# Altium project as14120_x31.PrjPCB (part 2 of 3)

## Sheet as14120_x31_fpga_ddr.SchDoc
size A2; PageSetup: Record=PageOptions|CenterHorizontal=True|CenterVertical=True|PrintScale=1.02|XCorrection=1.00|YCorrection=1.00|PrintKind=1|BorderSize=5000000|LeftOffset=0|BottomOffset=0|Orientation=2|PaperLength=4200|PaperWidth=2970|Scale=100|PaperSource=7|PrintQuality=-4|MediaType=1|DitherType=10|PaperKind=A3 (бумага продольной резки) (297 x 420 мм)|PrintScaleMode=1
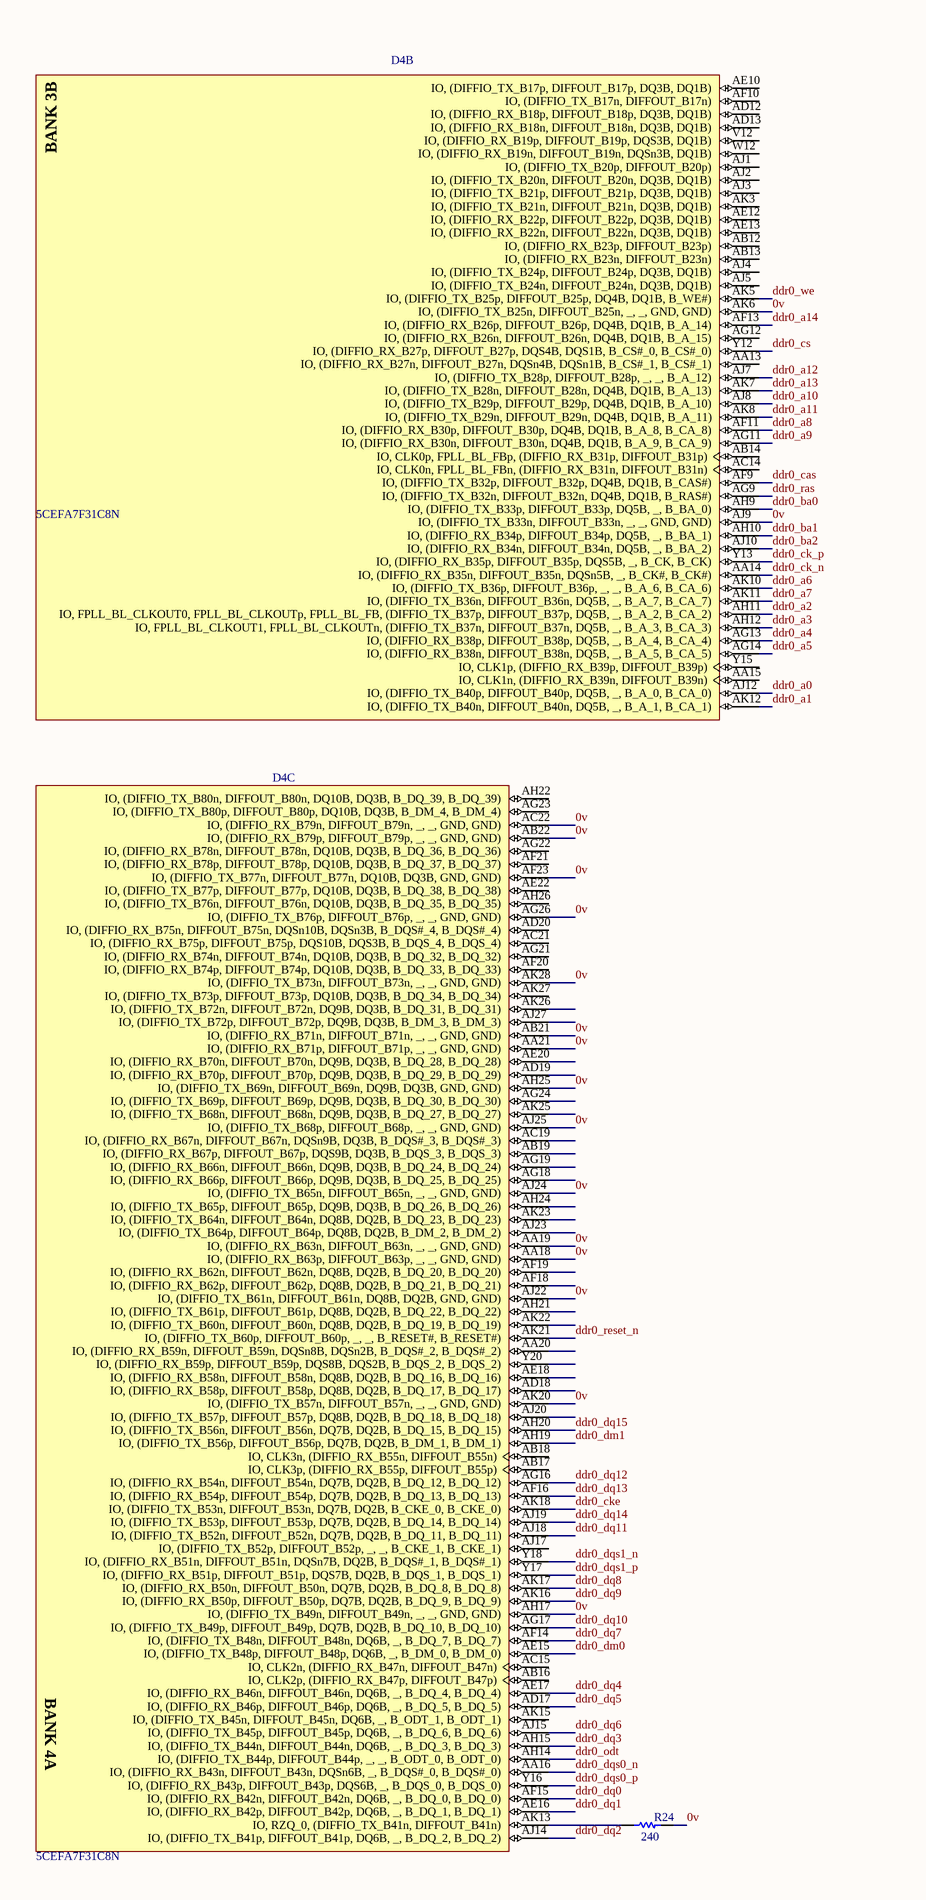
[diagram p3: as14120_x31_fpga_ddr.SchDoc, left]
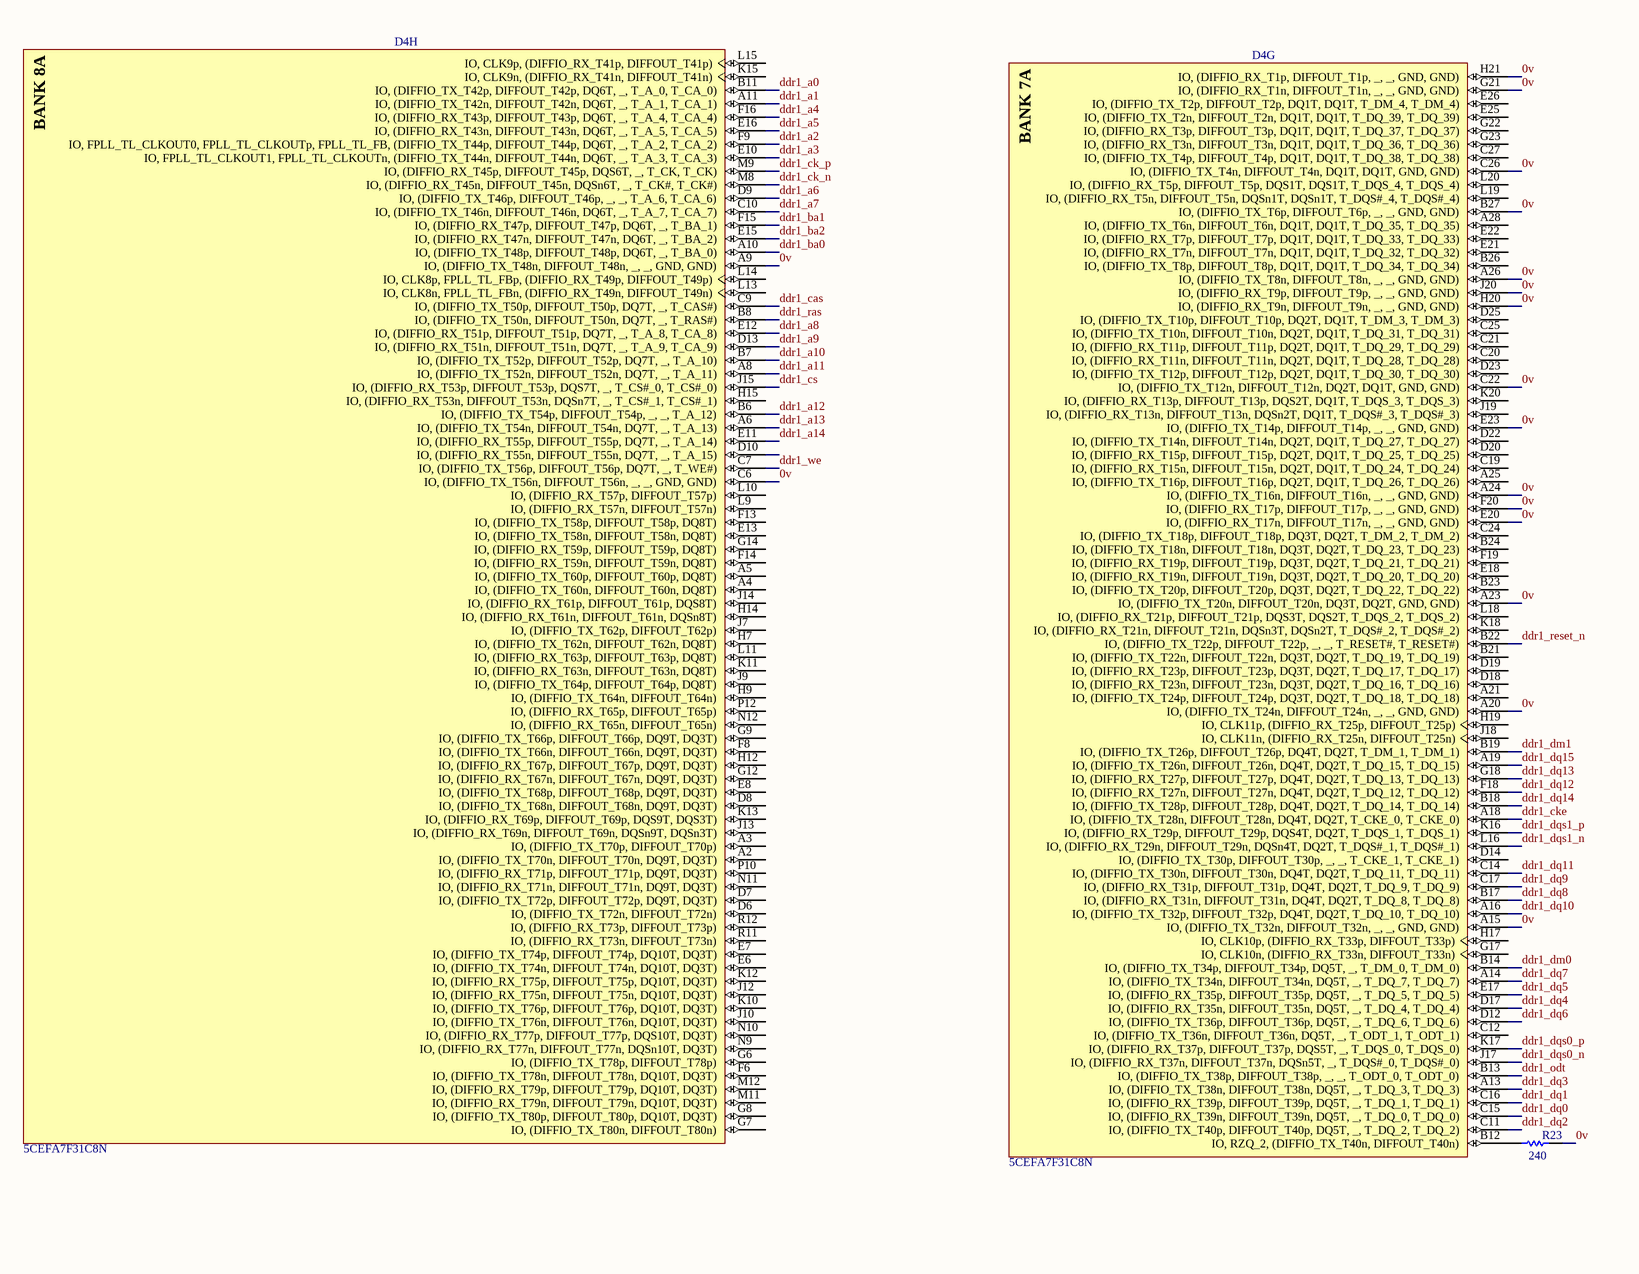
[diagram p4: as14120_x31_fpga_ddr.SchDoc, right]

### Parts
D4  5CEFA7F31C8N  [ALTR-896-FBGA-2000A]  (parts B,C,G,H of 13)
R23  value 240  [RESC0805(2012)_L]  (hidden comment: 1K 1% 0805(2012))
R24  value 240  [RESC0805(2012)_L]  (hidden comment: 1K 1% 0805(2012))

### Nets
0v: D4.A9(IO,_(DIFFIO_TX_T48n,_DIFFOUT_T48n,__,__,_GND,_GND)) D4.A15(IO,_(DIFFIO_TX_T32n,_DIFFOUT_T32n,__,__,_GND,_GND)) D4.A20(IO,_(DIFFIO_TX_T24n,_DIFFOUT_T24n,__,__,_GND,_GND)) D4.A23(IO,_(DIFFIO_TX_T20n,_DIFFOUT_T20n,_DQ3T,_DQ2T,_GND,_GND)) D4.A24(IO,_(DIFFIO_TX_T16n,_DIFFOUT_T16n,__,__,_GND,_GND)) D4.A26(IO,_(DIFFIO_TX_T8n,_DIFFOUT_T8n,__,__,_GND,_GND)) D4.AA18(IO,_(DIFFIO_RX_B63p,_DIFFOUT_B63p,__,__,_GND,_GND)) D4.AA19(IO,_(DIFFIO_RX_B63n,_DIFFOUT_B63n,__,__,_GND,_GND)) D4.AA21(IO,_(DIFFIO_RX_B71p,_DIFFOUT_B71p,__,__,_GND,_GND)) D4.AB21(IO,_(DIFFIO_RX_B71n,_DIFFOUT_B71n,__,__,_GND,_GND)) D4.AB22(IO,_(DIFFIO_RX_B79p,_DIFFOUT_B79p,__,__,_GND,_GND)) D4.AC22(IO,_(DIFFIO_RX_B79n,_DIFFOUT_B79n,__,__,_GND,_GND)) D4.AF23(IO,_(DIFFIO_TX_B77n,_DIFFOUT_B77n,_DQ10B,_DQ3B,_GND,_GND)) D4.AG26(IO,_(DIFFIO_TX_B76p,_DIFFOUT_B76p,__,__,_GND,_GND)) D4.AH17(IO,_(DIFFIO_TX_B49n,_DIFFOUT_B49n,__,__,_GND,_GND)) D4.AH25(IO,_(DIFFIO_TX_B69n,_DIFFOUT_B69n,_DQ9B,_DQ3B,_GND,_GND)) D4.AJ9(IO,_(DIFFIO_TX_B33n,_DIFFOUT_B33n,__,__,_GND,_GND)) D4.AJ22(IO,_(DIFFIO_TX_B61n,_DIFFOUT_B61n,_DQ8B,_DQ2B,_GND,_GND)) D4.AJ24(IO,_(DIFFIO_TX_B65n,_DIFFOUT_B65n,__,__,_GND,_GND)) D4.AJ25(IO,_(DIFFIO_TX_B68p,_DIFFOUT_B68p,__,__,_GND,_GND)) D4.AK6(IO,_(DIFFIO_TX_B25n,_DIFFOUT_B25n,__,__,_GND,_GND)) D4.AK20(IO,_(DIFFIO_TX_B57n,_DIFFOUT_B57n,__,__,_GND,_GND)) D4.AK28(IO,_(DIFFIO_TX_B73n,_DIFFOUT_B73n,__,__,_GND,_GND)) D4.B27(IO,_(DIFFIO_TX_T6p,_DIFFOUT_T6p,__,__,_GND,_GND)) D4.C6(IO,_(DIFFIO_TX_T56n,_DIFFOUT_T56n,__,__,_GND,_GND)) D4.C22(IO,_(DIFFIO_TX_T12n,_DIFFOUT_T12n,_DQ2T,_DQ1T,_GND,_GND)) D4.C26(IO,_(DIFFIO_TX_T4n,_DIFFOUT_T4n,_DQ1T,_DQ1T,_GND,_GND)) D4.E20(IO,_(DIFFIO_RX_T17n,_DIFFOUT_T17n,__,__,_GND,_GND)) D4.E23(IO,_(DIFFIO_TX_T14p,_DIFFOUT_T14p,__,__,_GND,_GND)) D4.F20(IO,_(DIFFIO_RX_T17p,_DIFFOUT_T17p,__,__,_GND,_GND)) D4.G21(IO,_(DIFFIO_RX_T1n,_DIFFOUT_T1n,__,__,_GND,_GND)) D4.H20(IO,_(DIFFIO_RX_T9n,_DIFFOUT_T9n,__,__,_GND,_GND)) D4.H21(IO,_(DIFFIO_RX_T1p,_DIFFOUT_T1p,__,__,_GND,_GND)) D4.J20(IO,_(DIFFIO_RX_T9p,_DIFFOUT_T9p,__,__,_GND,_GND)) R23.2 R24.2
ddr0_a0: D4.AJ12(IO,_(DIFFIO_TX_B40p,_DIFFOUT_B40p,_DQ5B,__,_B_A_0,_B_CA_0))
ddr0_a1: D4.AK12(IO,_(DIFFIO_TX_B40n,_DIFFOUT_B40n,_DQ5B,__,_B_A_1,_B_CA_1))
ddr0_a2: D4.AH11(IO,_FPLL_BL_CLKOUT0,_FPLL_BL_CLKOUTp,_FPLL_BL_FB,_(DIFFIO_TX_B37p,_DIFFOUT_B37p,_DQ5B,__,_B_A_2,_B_CA_2))
ddr0_a3: D4.AH12(IO,_FPLL_BL_CLKOUT1,_FPLL_BL_CLKOUTn,_(DIFFIO_TX_B37n,_DIFFOUT_B37n,_DQ5B,__,_B_A_3,_B_CA_3))
ddr0_a4: D4.AG13(IO,_(DIFFIO_RX_B38p,_DIFFOUT_B38p,_DQ5B,__,_B_A_4,_B_CA_4))
ddr0_a5: D4.AG14(IO,_(DIFFIO_RX_B38n,_DIFFOUT_B38n,_DQ5B,__,_B_A_5,_B_CA_5))
ddr0_a6: D4.AK10(IO,_(DIFFIO_TX_B36p,_DIFFOUT_B36p,__,__,_B_A_6,_B_CA_6))
ddr0_a7: D4.AK11(IO,_(DIFFIO_TX_B36n,_DIFFOUT_B36n,_DQ5B,__,_B_A_7,_B_CA_7))
ddr0_a8: D4.AF11(IO,_(DIFFIO_RX_B30p,_DIFFOUT_B30p,_DQ4B,_DQ1B,_B_A_8,_B_CA_8))
ddr0_a9: D4.AG11(IO,_(DIFFIO_RX_B30n,_DIFFOUT_B30n,_DQ4B,_DQ1B,_B_A_9,_B_CA_9))
ddr0_a10: D4.AJ8(IO,_(DIFFIO_TX_B29p,_DIFFOUT_B29p,_DQ4B,_DQ1B,_B_A_10))
ddr0_a11: D4.AK8(IO,_(DIFFIO_TX_B29n,_DIFFOUT_B29n,_DQ4B,_DQ1B,_B_A_11))
ddr0_a12: D4.AJ7(IO,_(DIFFIO_TX_B28p,_DIFFOUT_B28p,__,__,_B_A_12))
ddr0_a13: D4.AK7(IO,_(DIFFIO_TX_B28n,_DIFFOUT_B28n,_DQ4B,_DQ1B,_B_A_13))
ddr0_a14: D4.AF13(IO,_(DIFFIO_RX_B26p,_DIFFOUT_B26p,_DQ4B,_DQ1B,_B_A_14))
ddr0_ba0: D4.AH9(IO,_(DIFFIO_TX_B33p,_DIFFOUT_B33p,_DQ5B,__,_B_BA_0))
ddr0_ba1: D4.AH10(IO,_(DIFFIO_RX_B34p,_DIFFOUT_B34p,_DQ5B,__,_B_BA_1))
ddr0_ba2: D4.AJ10(IO,_(DIFFIO_RX_B34n,_DIFFOUT_B34n,_DQ5B,__,_B_BA_2))
ddr0_cas: D4.AF9(IO,_(DIFFIO_TX_B32p,_DIFFOUT_B32p,_DQ4B,_DQ1B,_B_CAS#))
ddr0_ck_n: D4.AA14(IO,_(DIFFIO_RX_B35n,_DIFFOUT_B35n,_DQSn5B,__,_B_CK#,_B_CK#))
ddr0_ck_p: D4.Y13(IO,_(DIFFIO_RX_B35p,_DIFFOUT_B35p,_DQS5B,__,_B_CK,_B_CK))
ddr0_cke: D4.AK18(IO,_(DIFFIO_TX_B53n,_DIFFOUT_B53n,_DQ7B,_DQ2B,_B_CKE_0,_B_CKE_0))
ddr0_cs: D4.Y12(IO,_(DIFFIO_RX_B27p,_DIFFOUT_B27p,_DQS4B,_DQS1B,_B_CS#_0,_B_CS#_0))
ddr0_dm0: D4.AE15(IO,_(DIFFIO_TX_B48p,_DIFFOUT_B48p,_DQ6B,__,_B_DM_0,_B_DM_0))
ddr0_dm1: D4.AH19(IO,_(DIFFIO_TX_B56p,_DIFFOUT_B56p,_DQ7B,_DQ2B,_B_DM_1,_B_DM_1))
ddr0_dq0: D4.AF15(IO,_(DIFFIO_RX_B42n,_DIFFOUT_B42n,_DQ6B,__,_B_DQ_0,_B_DQ_0))
ddr0_dq1: D4.AE16(IO,_(DIFFIO_RX_B42p,_DIFFOUT_B42p,_DQ6B,__,_B_DQ_1,_B_DQ_1))
ddr0_dq2: D4.AJ14(IO,_(DIFFIO_TX_B41p,_DIFFOUT_B41p,_DQ6B,__,_B_DQ_2,_B_DQ_2))
ddr0_dq3: D4.AH15(IO,_(DIFFIO_TX_B44n,_DIFFOUT_B44n,_DQ6B,__,_B_DQ_3,_B_DQ_3))
ddr0_dq4: D4.AE17(IO,_(DIFFIO_RX_B46n,_DIFFOUT_B46n,_DQ6B,__,_B_DQ_4,_B_DQ_4))
ddr0_dq5: D4.AD17(IO,_(DIFFIO_RX_B46p,_DIFFOUT_B46p,_DQ6B,__,_B_DQ_5,_B_DQ_5))
ddr0_dq6: D4.AJ15(IO,_(DIFFIO_TX_B45p,_DIFFOUT_B45p,_DQ6B,__,_B_DQ_6,_B_DQ_6))
ddr0_dq7: D4.AF14(IO,_(DIFFIO_TX_B48n,_DIFFOUT_B48n,_DQ6B,__,_B_DQ_7,_B_DQ_7))
ddr0_dq8: D4.AK17(IO,_(DIFFIO_RX_B50n,_DIFFOUT_B50n,_DQ7B,_DQ2B,_B_DQ_8,_B_DQ_8))
ddr0_dq9: D4.AK16(IO,_(DIFFIO_RX_B50p,_DIFFOUT_B50p,_DQ7B,_DQ2B,_B_DQ_9,_B_DQ_9))
ddr0_dq10: D4.AG17(IO,_(DIFFIO_TX_B49p,_DIFFOUT_B49p,_DQ7B,_DQ2B,_B_DQ_10,_B_DQ_10))
ddr0_dq11: D4.AJ18(IO,_(DIFFIO_TX_B52n,_DIFFOUT_B52n,_DQ7B,_DQ2B,_B_DQ_11,_B_DQ_11))
ddr0_dq12: D4.AG16(IO,_(DIFFIO_RX_B54n,_DIFFOUT_B54n,_DQ7B,_DQ2B,_B_DQ_12,_B_DQ_12))
ddr0_dq13: D4.AF16(IO,_(DIFFIO_RX_B54p,_DIFFOUT_B54p,_DQ7B,_DQ2B,_B_DQ_13,_B_DQ_13))
ddr0_dq14: D4.AJ19(IO,_(DIFFIO_TX_B53p,_DIFFOUT_B53p,_DQ7B,_DQ2B,_B_DQ_14,_B_DQ_14))
ddr0_dq15: D4.AH20(IO,_(DIFFIO_TX_B56n,_DIFFOUT_B56n,_DQ7B,_DQ2B,_B_DQ_15,_B_DQ_15))
ddr0_dqs0_n: D4.AA16(IO,_(DIFFIO_RX_B43n,_DIFFOUT_B43n,_DQSn6B,__,_B_DQS#_0,_B_DQS#_0))
ddr0_dqs0_p: D4.Y16(IO,_(DIFFIO_RX_B43p,_DIFFOUT_B43p,_DQS6B,__,_B_DQS_0,_B_DQS_0))
ddr0_dqs1_n: D4.Y18(IO,_(DIFFIO_RX_B51n,_DIFFOUT_B51n,_DQSn7B,_DQ2B,_B_DQS#_1,_B_DQS#_1))
ddr0_dqs1_p: D4.Y17(IO,_(DIFFIO_RX_B51p,_DIFFOUT_B51p,_DQS7B,_DQ2B,_B_DQS_1,_B_DQS_1))
ddr0_odt: D4.AH14(IO,_(DIFFIO_TX_B44p,_DIFFOUT_B44p,__,__,_B_ODT_0,_B_ODT_0))
ddr0_ras: D4.AG9(IO,_(DIFFIO_TX_B32n,_DIFFOUT_B32n,_DQ4B,_DQ1B,_B_RAS#))
ddr0_reset_n: D4.AK21(IO,_(DIFFIO_TX_B60p,_DIFFOUT_B60p,__,__,_B_RESET#,_B_RESET#))
ddr0_we: D4.AK5(IO,_(DIFFIO_TX_B25p,_DIFFOUT_B25p,_DQ4B,_DQ1B,_B_WE#))
ddr1_a0: D4.B11(IO,_(DIFFIO_TX_T42p,_DIFFOUT_T42p,_DQ6T,__,_T_A_0,_T_CA_0))
ddr1_a1: D4.A11(IO,_(DIFFIO_TX_T42n,_DIFFOUT_T42n,_DQ6T,__,_T_A_1,_T_CA_1))
ddr1_a2: D4.F9(IO,_FPLL_TL_CLKOUT0,_FPLL_TL_CLKOUTp,_FPLL_TL_FB,_(DIFFIO_TX_T44p,_DIFFOUT_T44p,_DQ6T,__,_T_A_2,_T_CA_2))
ddr1_a3: D4.E10(IO,_FPLL_TL_CLKOUT1,_FPLL_TL_CLKOUTn,_(DIFFIO_TX_T44n,_DIFFOUT_T44n,_DQ6T,__,_T_A_3,_T_CA_3))
ddr1_a4: D4.F16(IO,_(DIFFIO_RX_T43p,_DIFFOUT_T43p,_DQ6T,__,_T_A_4,_T_CA_4))
ddr1_a5: D4.E16(IO,_(DIFFIO_RX_T43n,_DIFFOUT_T43n,_DQ6T,__,_T_A_5,_T_CA_5))
ddr1_a6: D4.D9(IO,_(DIFFIO_TX_T46p,_DIFFOUT_T46p,__,__,_T_A_6,_T_CA_6))
ddr1_a7: D4.C10(IO,_(DIFFIO_TX_T46n,_DIFFOUT_T46n,_DQ6T,__,_T_A_7,_T_CA_7))
ddr1_a8: D4.E12(IO,_(DIFFIO_RX_T51p,_DIFFOUT_T51p,_DQ7T,__,_T_A_8,_T_CA_8))
ddr1_a9: D4.D13(IO,_(DIFFIO_RX_T51n,_DIFFOUT_T51n,_DQ7T,__,_T_A_9,_T_CA_9))
ddr1_a10: D4.B7(IO,_(DIFFIO_TX_T52p,_DIFFOUT_T52p,_DQ7T,__,_T_A_10))
ddr1_a11: D4.A8(IO,_(DIFFIO_TX_T52n,_DIFFOUT_T52n,_DQ7T,__,_T_A_11))
ddr1_a12: D4.B6(IO,_(DIFFIO_TX_T54p,_DIFFOUT_T54p,__,__,_T_A_12))
ddr1_a13: D4.A6(IO,_(DIFFIO_TX_T54n,_DIFFOUT_T54n,_DQ7T,__,_T_A_13))
ddr1_a14: D4.E11(IO,_(DIFFIO_RX_T55p,_DIFFOUT_T55p,_DQ7T,__,_T_A_14))
ddr1_ba0: D4.A10(IO,_(DIFFIO_TX_T48p,_DIFFOUT_T48p,_DQ6T,__,_T_BA_0))
ddr1_ba1: D4.F15(IO,_(DIFFIO_RX_T47p,_DIFFOUT_T47p,_DQ6T,__,_T_BA_1))
ddr1_ba2: D4.E15(IO,_(DIFFIO_RX_T47n,_DIFFOUT_T47n,_DQ6T,__,_T_BA_2))
ddr1_cas: D4.C9(IO,_(DIFFIO_TX_T50p,_DIFFOUT_T50p,_DQ7T,__,_T_CAS#))
ddr1_ck_n: D4.M8(IO,_(DIFFIO_RX_T45n,_DIFFOUT_T45n,_DQSn6T,__,_T_CK#,_T_CK#))
ddr1_ck_p: D4.M9(IO,_(DIFFIO_RX_T45p,_DIFFOUT_T45p,_DQS6T,__,_T_CK,_T_CK))
ddr1_cke: D4.A18(IO,_(DIFFIO_TX_T28n,_DIFFOUT_T28n,_DQ4T,_DQ2T,_T_CKE_0,_T_CKE_0))
ddr1_cs: D4.J15(IO,_(DIFFIO_RX_T53p,_DIFFOUT_T53p,_DQS7T,__,_T_CS#_0,_T_CS#_0))
ddr1_dm0: D4.B14(IO,_(DIFFIO_TX_T34p,_DIFFOUT_T34p,_DQ5T,__,_T_DM_0,_T_DM_0))
ddr1_dm1: D4.B19(IO,_(DIFFIO_TX_T26p,_DIFFOUT_T26p,_DQ4T,_DQ2T,_T_DM_1,_T_DM_1))
ddr1_dq0: D4.C15(IO,_(DIFFIO_RX_T39n,_DIFFOUT_T39n,_DQ5T,__,_T_DQ_0,_T_DQ_0))
ddr1_dq1: D4.C16(IO,_(DIFFIO_RX_T39p,_DIFFOUT_T39p,_DQ5T,__,_T_DQ_1,_T_DQ_1))
ddr1_dq2: D4.C11(IO,_(DIFFIO_TX_T40p,_DIFFOUT_T40p,_DQ5T,__,_T_DQ_2,_T_DQ_2))
ddr1_dq3: D4.A13(IO,_(DIFFIO_TX_T38n,_DIFFOUT_T38n,_DQ5T,__,_T_DQ_3,_T_DQ_3))
ddr1_dq4: D4.D17(IO,_(DIFFIO_RX_T35n,_DIFFOUT_T35n,_DQ5T,__,_T_DQ_4,_T_DQ_4))
ddr1_dq5: D4.E17(IO,_(DIFFIO_RX_T35p,_DIFFOUT_T35p,_DQ5T,__,_T_DQ_5,_T_DQ_5))
ddr1_dq6: D4.D12(IO,_(DIFFIO_TX_T36p,_DIFFOUT_T36p,_DQ5T,__,_T_DQ_6,_T_DQ_6))
ddr1_dq7: D4.A14(IO,_(DIFFIO_TX_T34n,_DIFFOUT_T34n,_DQ5T,__,_T_DQ_7,_T_DQ_7))
ddr1_dq8: D4.B17(IO,_(DIFFIO_RX_T31n,_DIFFOUT_T31n,_DQ4T,_DQ2T,_T_DQ_8,_T_DQ_8))
ddr1_dq9: D4.C17(IO,_(DIFFIO_RX_T31p,_DIFFOUT_T31p,_DQ4T,_DQ2T,_T_DQ_9,_T_DQ_9))
ddr1_dq10: D4.A16(IO,_(DIFFIO_TX_T32p,_DIFFOUT_T32p,_DQ4T,_DQ2T,_T_DQ_10,_T_DQ_10))
ddr1_dq11: D4.C14(IO,_(DIFFIO_TX_T30n,_DIFFOUT_T30n,_DQ4T,_DQ2T,_T_DQ_11,_T_DQ_11))
ddr1_dq12: D4.F18(IO,_(DIFFIO_RX_T27n,_DIFFOUT_T27n,_DQ4T,_DQ2T,_T_DQ_12,_T_DQ_12))
ddr1_dq13: D4.G18(IO,_(DIFFIO_RX_T27p,_DIFFOUT_T27p,_DQ4T,_DQ2T,_T_DQ_13,_T_DQ_13))
ddr1_dq14: D4.B18(IO,_(DIFFIO_TX_T28p,_DIFFOUT_T28p,_DQ4T,_DQ2T,_T_DQ_14,_T_DQ_14))
ddr1_dq15: D4.A19(IO,_(DIFFIO_TX_T26n,_DIFFOUT_T26n,_DQ4T,_DQ2T,_T_DQ_15,_T_DQ_15))
ddr1_dqs0_n: D4.J17(IO,_(DIFFIO_RX_T37n,_DIFFOUT_T37n,_DQSn5T,__,_T_DQS#_0,_T_DQS#_0))
ddr1_dqs0_p: D4.K17(IO,_(DIFFIO_RX_T37p,_DIFFOUT_T37p,_DQS5T,__,_T_DQS_0,_T_DQS_0))
ddr1_dqs1_n: D4.L16(IO,_(DIFFIO_RX_T29n,_DIFFOUT_T29n,_DQSn4T,_DQ2T,_T_DQS#_1,_T_DQS#_1))
ddr1_dqs1_p: D4.K16(IO,_(DIFFIO_RX_T29p,_DIFFOUT_T29p,_DQS4T,_DQ2T,_T_DQS_1,_T_DQS_1))
ddr1_odt: D4.B13(IO,_(DIFFIO_TX_T38p,_DIFFOUT_T38p,__,__,_T_ODT_0,_T_ODT_0))
ddr1_ras: D4.B8(IO,_(DIFFIO_TX_T50n,_DIFFOUT_T50n,_DQ7T,__,_T_RAS#))
ddr1_reset_n: D4.B22(IO,_(DIFFIO_TX_T22p,_DIFFOUT_T22p,__,__,_T_RESET#,_T_RESET#))
ddr1_we: D4.C7(IO,_(DIFFIO_TX_T56p,_DIFFOUT_T56p,_DQ7T,__,_T_WE#))
NetD4_AK13: D4.AK13(IO,_RZQ_0,_(DIFFIO_TX_B41n,_DIFFOUT_B41n)) R24.1
NetD4_B12: D4.B12(IO,_RZQ_2,_(DIFFIO_TX_T40n,_DIFFOUT_T40n)) R23.1

Not connected (* = marked no-connect by the designer): D4 A2(IO,_(DIFFIO_TX_T70n,_DIFFOUT_T70n,_DQ9T,_DQ3T)) A3(IO,_(DIFFIO_TX_T70p,_DIFFOUT_T70p)) A4(IO,_(DIFFIO_TX_T60n,_DIFFOUT_T60n,_DQ8T)) A5(IO,_(DIFFIO_TX_T60p,_DIFFOUT_T60p,_DQ8T)) A21(IO,_(DIFFIO_TX_T24p,_DIFFOUT_T24p,_DQ3T,_DQ2T,_T_DQ_18,_T_DQ_18)) A25(IO,_(DIFFIO_TX_T16p,_DIFFOUT_T16p,_DQ2T,_DQ1T,_T_DQ_26,_T_DQ_26)) A28(IO,_(DIFFIO_TX_T6n,_DIFFOUT_T6n,_DQ1T,_DQ1T,_T_DQ_35,_T_DQ_35)) AA13(IO,_(DIFFIO_RX_B27n,_DIFFOUT_B27n,_DQSn4B,_DQSn1B,_B_CS#_1,_B_CS#_1)) AA15(IO,_CLK1n,_(DIFFIO_RX_B39n,_DIFFOUT_B39n)) AA20(IO,_(DIFFIO_RX_B59n,_DIFFOUT_B59n,_DQSn8B,_DQSn2B,_B_DQS#_2,_B_DQS#_2)) AB12(IO,_(DIFFIO_RX_B23p,_DIFFOUT_B23p)) AB13(IO,_(DIFFIO_RX_B23n,_DIFFOUT_B23n)) AB14(IO,_CLK0p,_FPLL_BL_FBp,_(DIFFIO_RX_B31p,_DIFFOUT_B31p)) AB16(IO,_CLK2p,_(DIFFIO_RX_B47p,_DIFFOUT_B47p)) AB17(IO,_CLK3p,_(DIFFIO_RX_B55p,_DIFFOUT_B55p)) AB18(IO,_CLK3n,_(DIFFIO_RX_B55n,_DIFFOUT_B55n)) AB19(IO,_(DIFFIO_RX_B67p,_DIFFOUT_B67p,_DQS9B,_DQ3B,_B_DQS_3,_B_DQS_3)) AC14(IO,_CLK0n,_FPLL_BL_FBn,_(DIFFIO_RX_B31n,_DIFFOUT_B31n)) AC15(IO,_CLK2n,_(DIFFIO_RX_B47n,_DIFFOUT_B47n)) AC19(IO,_(DIFFIO_RX_B67n,_DIFFOUT_B67n,_DQSn9B,_DQ3B,_B_DQS#_3,_B_DQS#_3)) AC21(IO,_(DIFFIO_RX_B75p,_DIFFOUT_B75p,_DQS10B,_DQS3B,_B_DQS_4,_B_DQS_4)) AD12(IO,_(DIFFIO_RX_B18p,_DIFFOUT_B18p,_DQ3B,_DQ1B)) AD13(IO,_(DIFFIO_RX_B18n,_DIFFOUT_B18n,_DQ3B,_DQ1B)) AD18(IO,_(DIFFIO_RX_B58p,_DIFFOUT_B58p,_DQ8B,_DQ2B,_B_DQ_17,_B_DQ_17)) AD19(IO,_(DIFFIO_RX_B70p,_DIFFOUT_B70p,_DQ9B,_DQ3B,_B_DQ_29,_B_DQ_29)) AD20(IO,_(DIFFIO_RX_B75n,_DIFFOUT_B75n,_DQSn10B,_DQSn3B,_B_DQS#_4,_B_DQS#_4)) AE10(IO,_(DIFFIO_TX_B17p,_DIFFOUT_B17p,_DQ3B,_DQ1B)) AE12(IO,_(DIFFIO_RX_B22p,_DIFFOUT_B22p,_DQ3B,_DQ1B)) AE13(IO,_(DIFFIO_RX_B22n,_DIFFOUT_B22n,_DQ3B,_DQ1B)) AE18(IO,_(DIFFIO_RX_B58n,_DIFFOUT_B58n,_DQ8B,_DQ2B,_B_DQ_16,_B_DQ_16)) AE20(IO,_(DIFFIO_RX_B70n,_DIFFOUT_B70n,_DQ9B,_DQ3B,_B_DQ_28,_B_DQ_28)) AE22(IO,_(DIFFIO_TX_B77p,_DIFFOUT_B77p,_DQ10B,_DQ3B,_B_DQ_38,_B_DQ_38)) AF10(IO,_(DIFFIO_TX_B17n,_DIFFOUT_B17n)) AF18(IO,_(DIFFIO_RX_B62p,_DIFFOUT_B62p,_DQ8B,_DQ2B,_B_DQ_21,_B_DQ_21)) AF19(IO,_(DIFFIO_RX_B62n,_DIFFOUT_B62n,_DQ8B,_DQ2B,_B_DQ_20,_B_DQ_20)) AF20(IO,_(DIFFIO_RX_B74p,_DIFFOUT_B74p,_DQ10B,_DQ3B,_B_DQ_33,_B_DQ_33)) AF21(IO,_(DIFFIO_RX_B78p,_DIFFOUT_B78p,_DQ10B,_DQ3B,_B_DQ_37,_B_DQ_37)) AG12(IO,_(DIFFIO_RX_B26n,_DIFFOUT_B26n,_DQ4B,_DQ1B,_B_A_15)) AG18(IO,_(DIFFIO_RX_B66p,_DIFFOUT_B66p,_DQ9B,_DQ3B,_B_DQ_25,_B_DQ_25)) AG19(IO,_(DIFFIO_RX_B66n,_DIFFOUT_B66n,_DQ9B,_DQ3B,_B_DQ_24,_B_DQ_24)) AG21(IO,_(DIFFIO_RX_B74n,_DIFFOUT_B74n,_DQ10B,_DQ3B,_B_DQ_32,_B_DQ_32)) AG22(IO,_(DIFFIO_RX_B78n,_DIFFOUT_B78n,_DQ10B,_DQ3B,_B_DQ_36,_B_DQ_36)) AG23(IO,_(DIFFIO_TX_B80p,_DIFFOUT_B80p,_DQ10B,_DQ3B,_B_DM_4,_B_DM_4)) AG24(IO,_(DIFFIO_TX_B69p,_DIFFOUT_B69p,_DQ9B,_DQ3B,_B_DQ_30,_B_DQ_30)) AH21(IO,_(DIFFIO_TX_B61p,_DIFFOUT_B61p,_DQ8B,_DQ2B,_B_DQ_22,_B_DQ_22)) AH22(IO,_(DIFFIO_TX_B80n,_DIFFOUT_B80n,_DQ10B,_DQ3B,_B_DQ_39,_B_DQ_39)) AH24(IO,_(DIFFIO_TX_B65p,_DIFFOUT_B65p,_DQ9B,_DQ3B,_B_DQ_26,_B_DQ_26)) AH26(IO,_(DIFFIO_TX_B76n,_DIFFOUT_B76n,_DQ10B,_DQ3B,_B_DQ_35,_B_DQ_35)) AJ1(IO,_(DIFFIO_TX_B20p,_DIFFOUT_B20p)) AJ2(IO,_(DIFFIO_TX_B20n,_DIFFOUT_B20n,_DQ3B,_DQ1B)) AJ3(IO,_(DIFFIO_TX_B21p,_DIFFOUT_B21p,_DQ3B,_DQ1B)) AJ4(IO,_(DIFFIO_TX_B24p,_DIFFOUT_B24p,_DQ3B,_DQ1B)) AJ5(IO,_(DIFFIO_TX_B24n,_DIFFOUT_B24n,_DQ3B,_DQ1B)) AJ17(IO,_(DIFFIO_TX_B52p,_DIFFOUT_B52p,__,__,_B_CKE_1,_B_CKE_1)) AJ20(IO,_(DIFFIO_TX_B57p,_DIFFOUT_B57p,_DQ8B,_DQ2B,_B_DQ_18,_B_DQ_18)) AJ23(IO,_(DIFFIO_TX_B64p,_DIFFOUT_B64p,_DQ8B,_DQ2B,_B_DM_2,_B_DM_2)) AJ27(IO,_(DIFFIO_TX_B72p,_DIFFOUT_B72p,_DQ9B,_DQ3B,_B_DM_3,_B_DM_3)) AK3(IO,_(DIFFIO_TX_B21n,_DIFFOUT_B21n,_DQ3B,_DQ1B)) AK15(IO,_(DIFFIO_TX_B45n,_DIFFOUT_B45n,_DQ6B,__,_B_ODT_1,_B_ODT_1)) AK22(IO,_(DIFFIO_TX_B60n,_DIFFOUT_B60n,_DQ8B,_DQ2B,_B_DQ_19,_B_DQ_19)) AK23(IO,_(DIFFIO_TX_B64n,_DIFFOUT_B64n,_DQ8B,_DQ2B,_B_DQ_23,_B_DQ_23)) AK25(IO,_(DIFFIO_TX_B68n,_DIFFOUT_B68n,_DQ9B,_DQ3B,_B_DQ_27,_B_DQ_27)) AK26(IO,_(DIFFIO_TX_B72n,_DIFFOUT_B72n,_DQ9B,_DQ3B,_B_DQ_31,_B_DQ_31)) AK27(IO,_(DIFFIO_TX_B73p,_DIFFOUT_B73p,_DQ10B,_DQ3B,_B_DQ_34,_B_DQ_34)) B21(IO,_(DIFFIO_TX_T22n,_DIFFOUT_T22n,_DQ3T,_DQ2T,_T_DQ_19,_T_DQ_19)) B23(IO,_(DIFFIO_TX_T20p,_DIFFOUT_T20p,_DQ3T,_DQ2T,_T_DQ_22,_T_DQ_22)) B24(IO,_(DIFFIO_TX_T18n,_DIFFOUT_T18n,_DQ3T,_DQ2T,_T_DQ_23,_T_DQ_23)) B26(IO,_(DIFFIO_TX_T8p,_DIFFOUT_T8p,_DQ1T,_DQ1T,_T_DQ_34,_T_DQ_34)) C12(IO,_(DIFFIO_TX_T36n,_DIFFOUT_T36n,_DQ5T,__,_T_ODT_1,_T_ODT_1)) C19(IO,_(DIFFIO_RX_T15n,_DIFFOUT_T15n,_DQ2T,_DQ1T,_T_DQ_24,_T_DQ_24)) C20(IO,_(DIFFIO_RX_T11n,_DIFFOUT_T11n,_DQ2T,_DQ1T,_T_DQ_28,_T_DQ_28)) C21(IO,_(DIFFIO_RX_T11p,_DIFFOUT_T11p,_DQ2T,_DQ1T,_T_DQ_29,_T_DQ_29)) C24(IO,_(DIFFIO_TX_T18p,_DIFFOUT_T18p,_DQ3T,_DQ2T,_T_DM_2,_T_DM_2)) C25(IO,_(DIFFIO_TX_T10n,_DIFFOUT_T10n,_DQ2T,_DQ1T,_T_DQ_31,_T_DQ_31)) C27(IO,_(DIFFIO_TX_T4p,_DIFFOUT_T4p,_DQ1T,_DQ1T,_T_DQ_38,_T_DQ_38)) D6(IO,_(DIFFIO_TX_T72n,_DIFFOUT_T72n)) D7(IO,_(DIFFIO_TX_T72p,_DIFFOUT_T72p,_DQ9T,_DQ3T)) D8(IO,_(DIFFIO_TX_T68n,_DIFFOUT_T68n,_DQ9T,_DQ3T)) D10(IO,_(DIFFIO_RX_T55n,_DIFFOUT_T55n,_DQ7T,__,_T_A_15)) D14(IO,_(DIFFIO_TX_T30p,_DIFFOUT_T30p,__,__,_T_CKE_1,_T_CKE_1)) D18(IO,_(DIFFIO_RX_T23n,_DIFFOUT_T23n,_DQ3T,_DQ2T,_T_DQ_16,_T_DQ_16)) D19(IO,_(DIFFIO_RX_T23p,_DIFFOUT_T23p,_DQ3T,_DQ2T,_T_DQ_17,_T_DQ_17)) D20(IO,_(DIFFIO_RX_T15p,_DIFFOUT_T15p,_DQ2T,_DQ1T,_T_DQ_25,_T_DQ_25)) D22(IO,_(DIFFIO_TX_T14n,_DIFFOUT_T14n,_DQ2T,_DQ1T,_T_DQ_27,_T_DQ_27)) D23(IO,_(DIFFIO_TX_T12p,_DIFFOUT_T12p,_DQ2T,_DQ1T,_T_DQ_30,_T_DQ_30)) D25(IO,_(DIFFIO_TX_T10p,_DIFFOUT_T10p,_DQ2T,_DQ1T,_T_DM_3,_T_DM_3)) E6(IO,_(DIFFIO_TX_T74n,_DIFFOUT_T74n,_DQ10T,_DQ3T)) E7(IO,_(DIFFIO_TX_T74p,_DIFFOUT_T74p,_DQ10T,_DQ3T)) E8(IO,_(DIFFIO_TX_T68p,_DIFFOUT_T68p,_DQ9T,_DQ3T)) E13(IO,_(DIFFIO_TX_T58n,_DIFFOUT_T58n,_DQ8T)) E18(IO,_(DIFFIO_RX_T19n,_DIFFOUT_T19n,_DQ3T,_DQ2T,_T_DQ_20,_T_DQ_20)) E21(IO,_(DIFFIO_RX_T7n,_DIFFOUT_T7n,_DQ1T,_DQ1T,_T_DQ_32,_T_DQ_32)) E22(IO,_(DIFFIO_RX_T7p,_DIFFOUT_T7p,_DQ1T,_DQ1T,_T_DQ_33,_T_DQ_33)) E25(IO,_(DIFFIO_TX_T2n,_DIFFOUT_T2n,_DQ1T,_DQ1T,_T_DQ_39,_T_DQ_39)) E26(IO,_(DIFFIO_TX_T2p,_DIFFOUT_T2p,_DQ1T,_DQ1T,_T_DM_4,_T_DM_4)) F6(IO,_(DIFFIO_TX_T78n,_DIFFOUT_T78n,_DQ10T,_DQ3T)) F8(IO,_(DIFFIO_TX_T66n,_DIFFOUT_T66n,_DQ9T,_DQ3T)) F13(IO,_(DIFFIO_TX_T58p,_DIFFOUT_T58p,_DQ8T)) F14(IO,_(DIFFIO_RX_T59n,_DIFFOUT_T59n,_DQ8T)) F19(IO,_(DIFFIO_RX_T19p,_DIFFOUT_T19p,_DQ3T,_DQ2T,_T_DQ_21,_T_DQ_21)) G6(IO,_(DIFFIO_TX_T78p,_DIFFOUT_T78p)) G7(IO,_(DIFFIO_TX_T80n,_DIFFOUT_T80n)) G8(IO,_(DIFFIO_TX_T80p,_DIFFOUT_T80p,_DQ10T,_DQ3T)) G9(IO,_(DIFFIO_TX_T66p,_DIFFOUT_T66p,_DQ9T,_DQ3T)) G12(IO,_(DIFFIO_RX_T67n,_DIFFOUT_T67n,_DQ9T,_DQ3T)) G14(IO,_(DIFFIO_RX_T59p,_DIFFOUT_T59p,_DQ8T)) G17(IO,_CLK10n,_(DIFFIO_RX_T33n,_DIFFOUT_T33n)) G22(IO,_(DIFFIO_RX_T3p,_DIFFOUT_T3p,_DQ1T,_DQ1T,_T_DQ_37,_T_DQ_37)) G23(IO,_(DIFFIO_RX_T3n,_DIFFOUT_T3n,_DQ1T,_DQ1T,_T_DQ_36,_T_DQ_36)) H7(IO,_(DIFFIO_TX_T62n,_DIFFOUT_T62n,_DQ8T)) H9(IO,_(DIFFIO_TX_T64n,_DIFFOUT_T64n)) H12(IO,_(DIFFIO_RX_T67p,_DIFFOUT_T67p,_DQ9T,_DQ3T)) H14(IO,_(DIFFIO_RX_T61n,_DIFFOUT_T61n,_DQSn8T)) H15(IO,_(DIFFIO_RX_T53n,_DIFFOUT_T53n,_DQSn7T,__,_T_CS#_1,_T_CS#_1)) H17(IO,_CLK10p,_(DIFFIO_RX_T33p,_DIFFOUT_T33p)) H19(IO,_CLK11p,_(DIFFIO_RX_T25p,_DIFFOUT_T25p)) J7(IO,_(DIFFIO_TX_T62p,_DIFFOUT_T62p)) J9(IO,_(DIFFIO_TX_T64p,_DIFFOUT_T64p,_DQ8T)) J10(IO,_(DIFFIO_TX_T76n,_DIFFOUT_T76n,_DQ10T,_DQ3T)) J12(IO,_(DIFFIO_RX_T75n,_DIFFOUT_T75n,_DQ10T,_DQ3T)) J13(IO,_(DIFFIO_RX_T69n,_DIFFOUT_T69n,_DQSn9T,_DQSn3T)) J14(IO,_(DIFFIO_RX_T61p,_DIFFOUT_T61p,_DQS8T)) J18(IO,_CLK11n,_(DIFFIO_RX_T25n,_DIFFOUT_T25n)) J19(IO,_(DIFFIO_RX_T13n,_DIFFOUT_T13n,_DQSn2T,_DQ1T,_T_DQS#_3,_T_DQS#_3)) K10(IO,_(DIFFIO_TX_T76p,_DIFFOUT_T76p,_DQ10T,_DQ3T)) K11(IO,_(DIFFIO_RX_T63n,_DIFFOUT_T63n,_DQ8T)) K12(IO,_(DIFFIO_RX_T75p,_DIFFOUT_T75p,_DQ10T,_DQ3T)) K13(IO,_(DIFFIO_RX_T69p,_DIFFOUT_T69p,_DQS9T,_DQS3T)) K15(IO,_CLK9n,_(DIFFIO_RX_T41n,_DIFFOUT_T41n)) K18(IO,_(DIFFIO_RX_T21n,_DIFFOUT_T21n,_DQSn3T,_DQSn2T,_T_DQS#_2,_T_DQS#_2)) K20(IO,_(DIFFIO_RX_T13p,_DIFFOUT_T13p,_DQS2T,_DQ1T,_T_DQS_3,_T_DQS_3)) L9(IO,_(DIFFIO_RX_T57n,_DIFFOUT_T57n)) L10(IO,_(DIFFIO_RX_T57p,_DIFFOUT_T57p)) L11(IO,_(DIFFIO_RX_T63p,_DIFFOUT_T63p,_DQ8T)) L13(IO,_CLK8n,_FPLL_TL_FBn,_(DIFFIO_RX_T49n,_DIFFOUT_T49n)) L14(IO,_CLK8p,_FPLL_TL_FBp,_(DIFFIO_RX_T49p,_DIFFOUT_T49p)) L15(IO,_CLK9p,_(DIFFIO_RX_T41p,_DIFFOUT_T41p)) L18(IO,_(DIFFIO_RX_T21p,_DIFFOUT_T21p,_DQS3T,_DQS2T,_T_DQS_2,_T_DQS_2)) L19(IO,_(DIFFIO_RX_T5n,_DIFFOUT_T5n,_DQSn1T,_DQSn1T,_T_DQS#_4,_T_DQS#_4)) L20(IO,_(DIFFIO_RX_T5p,_DIFFOUT_T5p,_DQS1T,_DQS1T,_T_DQS_4,_T_DQS_4)) M11(IO,_(DIFFIO_RX_T79n,_DIFFOUT_T79n,_DQ10T,_DQ3T)) M12(IO,_(DIFFIO_RX_T79p,_DIFFOUT_T79p,_DQ10T,_DQ3T)) N9(IO,_(DIFFIO_RX_T77n,_DIFFOUT_T77n,_DQSn10T,_DQ3T)) N10(IO,_(DIFFIO_RX_T77p,_DIFFOUT_T77p,_DQS10T,_DQ3T)) N11(IO,_(DIFFIO_RX_T71n,_DIFFOUT_T71n,_DQ9T,_DQ3T)) N12(IO,_(DIFFIO_RX_T65n,_DIFFOUT_T65n)) P10(IO,_(DIFFIO_RX_T71p,_DIFFOUT_T71p,_DQ9T,_DQ3T)) P12(IO,_(DIFFIO_RX_T65p,_DIFFOUT_T65p)) R11(IO,_(DIFFIO_RX_T73n,_DIFFOUT_T73n)) R12(IO,_(DIFFIO_RX_T73p,_DIFFOUT_T73p)) V12(IO,_(DIFFIO_RX_B19p,_DIFFOUT_B19p,_DQS3B,_DQ1B)) W12(IO,_(DIFFIO_RX_B19n,_DIFFOUT_B19n,_DQSn3B,_DQ1B)) Y15(IO,_CLK1p,_(DIFFIO_RX_B39p,_DIFFOUT_B39p)) Y20(IO,_(DIFFIO_RX_B59p,_DIFFOUT_B59p,_DQS8B,_DQS2B,_B_DQS_2,_B_DQS_2))

### Notes on the sheet
- Title
- Size:
- Date:
- File:
- A2
- Number:
- Time:
- Revision:
- Sheet
- of
- (in symbol 5CEFA7F31C8N, part B) BANK 3B
- (in symbol 5CEFA7F31C8N, part C) BANK 4A
- (in symbol 5CEFA7F31C8N, part G) BANK 7A
- (in symbol 5CEFA7F31C8N, part H) BANK 8A

### Library data of the parts
D4 = 5CEFA7F31C8N: as D4 on sheet as14120_x31_fpga_ttl; DatasheetVersion: Rev. 3.1; PackageReference: 896-FBGA-2000A; PackageDescription: 896-Pin FineLine Ball-Grid Array (FBGA), Body 31 x 31 mm, Pitch 1 mm; Supplier 1: Digi-Key; Supplier Part Number 1: 544-2768-ND; Supplier 2: Mouser; Supplier Part Number 2: 989-5CEFA7F31C8N; RoHS: RoHS Compliant; Subcategory: Cyclone V E; Voltage Supply: 1.07 to 1.13 V; Mounting Technology: Surface Mount; Code_JEDEC: MS-034-AAN-1; PartNumber: 5CEFA7F31C8N; ComponentLink1Description: Manufacturer URL; ComponentLink1URL: http://www.altera.com; ComponentLink2Description: Datasheet; ComponentLink2URL: http://www.altera.com/literature/hb/cyclone-v/cv_51002.pdf; ComponentLink3Description: Package Specification; ComponentLink3URL: http://www.altera.com/devicepackaging/04R00435-01.pdf; ComponentLink4Description: Device Handbook URL; ComponentLink4URL: http://www.altera.com/literature/hb/cyclone-v/cyclone5_handbook.pdf; ComponentLink5Description: Device Overview URL; ComponentLink5URL: http://www.altera.com/literature/hb/cyclone-v/cv_51001.pdf; ComponentLink6Description: Device Pin-Out URL; ComponentLink6URL: http://www.altera.com/literature/dp/cyclone-v/1.1.txt; ComponentLink7Description: Product URL; ComponentLink7URL: http://www.buyaltera.com/scripts/partsearch.dll?Detail&name=5CEFA7F31C8N-ND
R23 R24 = RES_0805: as R57 on sheet as14120_x31_usb; Tolerance: 1 %; Power: 0.125 W; Technology: SMT

## Sheet as14120_x31_fpga_cypress.SchDoc
size A3
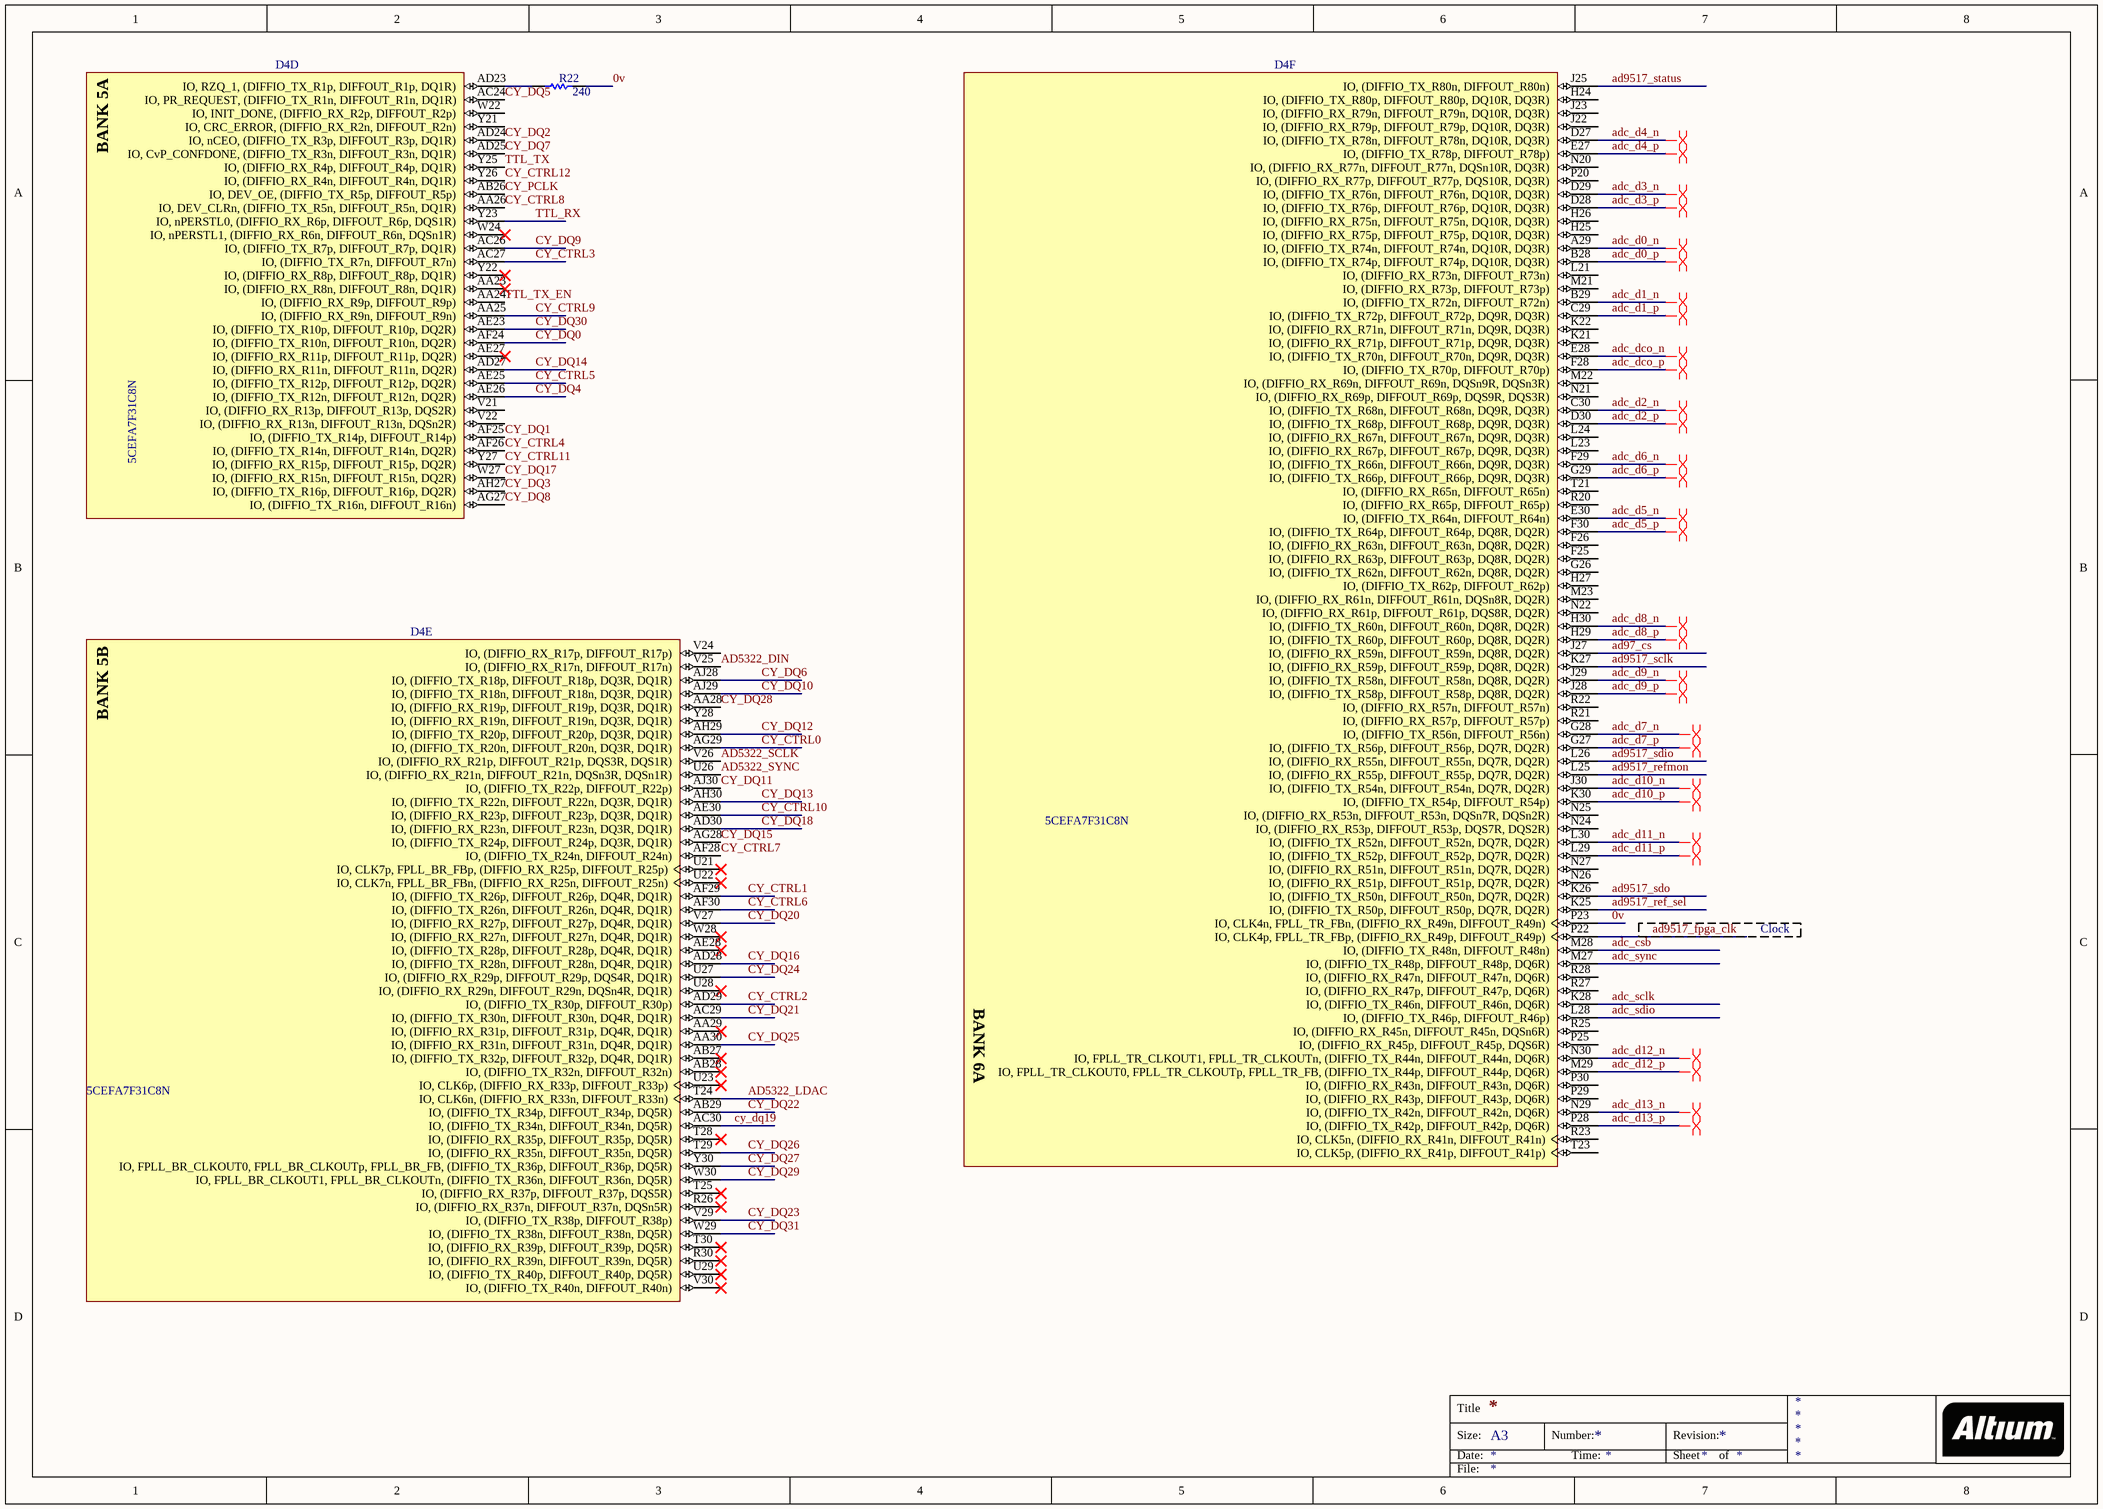
[diagram p5: as14120_x31_fpga_cypress.SchDoc]

### Parts
D4  5CEFA7F31C8N  [ALTR-896-FBGA-2000A]  (parts D,E,F of 13)
R22  240  [RESC0603(1608)_L]

### Nets
0v: D4.P23(IO,_CLK4n,_FPLL_TR_FBn,_(DIFFIO_RX_R49n,_DIFFOUT_R49n)) R22.2
ad97_cs: D4.J27(IO,_(DIFFIO_RX_R59n,_DIFFOUT_R59n,_DQ8R,_DQ2R))
AD5322_DIN: D4.V25(IO,_(DIFFIO_RX_R17n,_DIFFOUT_R17n))
AD5322_LDAC: D4.T24(IO,_CLK6n,_(DIFFIO_RX_R33n,_DIFFOUT_R33n))
AD5322_SCLK: D4.V26(IO,_(DIFFIO_RX_R21p,_DIFFOUT_R21p,_DQS3R,_DQS1R))
AD5322_SYNC: D4.U26(IO,_(DIFFIO_RX_R21n,_DIFFOUT_R21n,_DQSn3R,_DQSn1R))
ad9517_fpga_clk: D4.P22(IO,_CLK4p,_FPLL_TR_FBp,_(DIFFIO_RX_R49p,_DIFFOUT_R49p))
ad9517_ref_sel: D4.K25(IO,_(DIFFIO_TX_R50p,_DIFFOUT_R50p,_DQ7R,_DQ2R))
ad9517_refmon: D4.L25(IO,_(DIFFIO_RX_R55p,_DIFFOUT_R55p,_DQ7R,_DQ2R))
ad9517_sclk: D4.K27(IO,_(DIFFIO_RX_R59p,_DIFFOUT_R59p,_DQ8R,_DQ2R))
ad9517_sdio: D4.L26(IO,_(DIFFIO_RX_R55n,_DIFFOUT_R55n,_DQ7R,_DQ2R))
ad9517_sdo: D4.K26(IO,_(DIFFIO_TX_R50n,_DIFFOUT_R50n,_DQ7R,_DQ2R))
ad9517_status: D4.J25(IO,_(DIFFIO_TX_R80n,_DIFFOUT_R80n))
adc_csb: D4.M28(IO,_(DIFFIO_TX_R48n,_DIFFOUT_R48n))
adc_d0_n: D4.A29(IO,_(DIFFIO_TX_R74n,_DIFFOUT_R74n,_DQ10R,_DQ3R))
adc_d0_p: D4.B28(IO,_(DIFFIO_TX_R74p,_DIFFOUT_R74p,_DQ10R,_DQ3R))
adc_d1_n: D4.B29(IO,_(DIFFIO_TX_R72n,_DIFFOUT_R72n))
adc_d1_p: D4.C29(IO,_(DIFFIO_TX_R72p,_DIFFOUT_R72p,_DQ9R,_DQ3R))
adc_d2_n: D4.C30(IO,_(DIFFIO_TX_R68n,_DIFFOUT_R68n,_DQ9R,_DQ3R))
adc_d2_p: D4.D30(IO,_(DIFFIO_TX_R68p,_DIFFOUT_R68p,_DQ9R,_DQ3R))
adc_d3_n: D4.D29(IO,_(DIFFIO_TX_R76n,_DIFFOUT_R76n,_DQ10R,_DQ3R))
adc_d3_p: D4.D28(IO,_(DIFFIO_TX_R76p,_DIFFOUT_R76p,_DQ10R,_DQ3R))
adc_d4_n: D4.D27(IO,_(DIFFIO_TX_R78n,_DIFFOUT_R78n,_DQ10R,_DQ3R))
adc_d4_p: D4.E27(IO,_(DIFFIO_TX_R78p,_DIFFOUT_R78p))
adc_d5_n: D4.E30(IO,_(DIFFIO_TX_R64n,_DIFFOUT_R64n))
adc_d5_p: D4.F30(IO,_(DIFFIO_TX_R64p,_DIFFOUT_R64p,_DQ8R,_DQ2R))
adc_d6_n: D4.F29(IO,_(DIFFIO_TX_R66n,_DIFFOUT_R66n,_DQ9R,_DQ3R))
adc_d6_p: D4.G29(IO,_(DIFFIO_TX_R66p,_DIFFOUT_R66p,_DQ9R,_DQ3R))
adc_d7_n: D4.G28(IO,_(DIFFIO_TX_R56n,_DIFFOUT_R56n))
adc_d7_p: D4.G27(IO,_(DIFFIO_TX_R56p,_DIFFOUT_R56p,_DQ7R,_DQ2R))
adc_d8_n: D4.H30(IO,_(DIFFIO_TX_R60n,_DIFFOUT_R60n,_DQ8R,_DQ2R))
adc_d8_p: D4.H29(IO,_(DIFFIO_TX_R60p,_DIFFOUT_R60p,_DQ8R,_DQ2R))
adc_d9_n: D4.J29(IO,_(DIFFIO_TX_R58n,_DIFFOUT_R58n,_DQ8R,_DQ2R))
adc_d9_p: D4.J28(IO,_(DIFFIO_TX_R58p,_DIFFOUT_R58p,_DQ8R,_DQ2R))
adc_d10_n: D4.J30(IO,_(DIFFIO_TX_R54n,_DIFFOUT_R54n,_DQ7R,_DQ2R))
adc_d10_p: D4.K30(IO,_(DIFFIO_TX_R54p,_DIFFOUT_R54p))
adc_d11_n: D4.L30(IO,_(DIFFIO_TX_R52n,_DIFFOUT_R52n,_DQ7R,_DQ2R))
adc_d11_p: D4.L29(IO,_(DIFFIO_TX_R52p,_DIFFOUT_R52p,_DQ7R,_DQ2R))
adc_d12_n: D4.N30(IO,_FPLL_TR_CLKOUT1,_FPLL_TR_CLKOUTn,_(DIFFIO_TX_R44n,_DIFFOUT_R44n,_DQ6R))
adc_d12_p: D4.M29(IO,_FPLL_TR_CLKOUT0,_FPLL_TR_CLKOUTp,_FPLL_TR_FB,_(DIFFIO_TX_R44p,_DIFFOUT_R44p,_DQ6R))
adc_d13_n: D4.N29(IO,_(DIFFIO_TX_R42n,_DIFFOUT_R42n,_DQ6R))
adc_d13_p: D4.P28(IO,_(DIFFIO_TX_R42p,_DIFFOUT_R42p,_DQ6R))
adc_dco_n: D4.E28(IO,_(DIFFIO_TX_R70n,_DIFFOUT_R70n,_DQ9R,_DQ3R))
adc_dco_p: D4.F28(IO,_(DIFFIO_TX_R70p,_DIFFOUT_R70p))
adc_sclk: D4.K28(IO,_(DIFFIO_TX_R46n,_DIFFOUT_R46n,_DQ6R))
adc_sdio: D4.L28(IO,_(DIFFIO_TX_R46p,_DIFFOUT_R46p))
adc_sync: D4.M27(IO,_(DIFFIO_TX_R48p,_DIFFOUT_R48p,_DQ6R))
cy_ctrl0: D4.AG29(IO,_(DIFFIO_TX_R20n,_DIFFOUT_R20n,_DQ3R,_DQ1R))
cy_ctrl1: D4.AF29(IO,_(DIFFIO_TX_R26p,_DIFFOUT_R26p,_DQ4R,_DQ1R))
cy_ctrl2: D4.AD29(IO,_(DIFFIO_TX_R30p,_DIFFOUT_R30p))
cy_ctrl3: D4.AC27(IO,_(DIFFIO_TX_R7n,_DIFFOUT_R7n))
cy_ctrl4: D4.AF26(IO,_(DIFFIO_TX_R14n,_DIFFOUT_R14n,_DQ2R))
cy_ctrl5: D4.AE25(IO,_(DIFFIO_TX_R12p,_DIFFOUT_R12p,_DQ2R))
cy_ctrl6: D4.AF30(IO,_(DIFFIO_TX_R26n,_DIFFOUT_R26n,_DQ4R,_DQ1R))
cy_ctrl7: D4.AF28(IO,_(DIFFIO_TX_R24n,_DIFFOUT_R24n))
cy_ctrl8: D4.AA26(IO,_DEV_CLRn,_(DIFFIO_TX_R5n,_DIFFOUT_R5n,_DQ1R))
cy_ctrl9: D4.AA25(IO,_(DIFFIO_RX_R9n,_DIFFOUT_R9n))
cy_ctrl10: D4.AE30(IO,_(DIFFIO_RX_R23p,_DIFFOUT_R23p,_DQ3R,_DQ1R))
cy_ctrl11: D4.Y27(IO,_(DIFFIO_RX_R15p,_DIFFOUT_R15p,_DQ2R))
cy_ctrl12: D4.Y26(IO,_(DIFFIO_RX_R4n,_DIFFOUT_R4n,_DQ1R))
cy_dq0: D4.AF24(IO,_(DIFFIO_TX_R10n,_DIFFOUT_R10n,_DQ2R))
cy_dq1: D4.AF25(IO,_(DIFFIO_TX_R14p,_DIFFOUT_R14p))
cy_dq2: D4.AD24(IO,_nCEO,_(DIFFIO_TX_R3p,_DIFFOUT_R3p,_DQ1R))
cy_dq3: D4.AH27(IO,_(DIFFIO_TX_R16p,_DIFFOUT_R16p,_DQ2R))
cy_dq4: D4.AE26(IO,_(DIFFIO_TX_R12n,_DIFFOUT_R12n,_DQ2R))
cy_dq5: D4.AC24(IO,_PR_REQUEST,_(DIFFIO_TX_R1n,_DIFFOUT_R1n,_DQ1R))
cy_dq6: D4.AJ28(IO,_(DIFFIO_TX_R18p,_DIFFOUT_R18p,_DQ3R,_DQ1R))
cy_dq7: D4.AD25(IO,_CvP_CONFDONE,_(DIFFIO_TX_R3n,_DIFFOUT_R3n,_DQ1R))
cy_dq8: D4.AG27(IO,_(DIFFIO_TX_R16n,_DIFFOUT_R16n))
cy_dq9: D4.AC26(IO,_(DIFFIO_TX_R7p,_DIFFOUT_R7p,_DQ1R))
cy_dq10: D4.AJ29(IO,_(DIFFIO_TX_R18n,_DIFFOUT_R18n,_DQ3R,_DQ1R))
cy_dq11: D4.AJ30(IO,_(DIFFIO_TX_R22p,_DIFFOUT_R22p))
cy_dq12: D4.AH29(IO,_(DIFFIO_TX_R20p,_DIFFOUT_R20p,_DQ3R,_DQ1R))
cy_dq13: D4.AH30(IO,_(DIFFIO_TX_R22n,_DIFFOUT_R22n,_DQ3R,_DQ1R))
cy_dq14: D4.AD27(IO,_(DIFFIO_RX_R11n,_DIFFOUT_R11n,_DQ2R))
cy_dq15: D4.AG28(IO,_(DIFFIO_TX_R24p,_DIFFOUT_R24p,_DQ3R,_DQ1R))
cy_dq16: D4.AD28(IO,_(DIFFIO_TX_R28n,_DIFFOUT_R28n,_DQ4R,_DQ1R))
cy_dq17: D4.W27(IO,_(DIFFIO_RX_R15n,_DIFFOUT_R15n,_DQ2R))
cy_dq18: D4.AD30(IO,_(DIFFIO_RX_R23n,_DIFFOUT_R23n,_DQ3R,_DQ1R))
cy_dq19: D4.AC30(IO,_(DIFFIO_TX_R34n,_DIFFOUT_R34n,_DQ5R))
cy_dq20: D4.V27(IO,_(DIFFIO_RX_R27p,_DIFFOUT_R27p,_DQ4R,_DQ1R))
cy_dq21: D4.AC29(IO,_(DIFFIO_TX_R30n,_DIFFOUT_R30n,_DQ4R,_DQ1R))
cy_dq22: D4.AB29(IO,_(DIFFIO_TX_R34p,_DIFFOUT_R34p,_DQ5R))
cy_dq23: D4.V29(IO,_(DIFFIO_TX_R38p,_DIFFOUT_R38p))
cy_dq24: D4.U27(IO,_(DIFFIO_RX_R29p,_DIFFOUT_R29p,_DQS4R,_DQ1R))
cy_dq25: D4.AA30(IO,_(DIFFIO_RX_R31n,_DIFFOUT_R31n,_DQ4R,_DQ1R))
cy_dq26: D4.T29(IO,_(DIFFIO_RX_R35n,_DIFFOUT_R35n,_DQ5R))
cy_dq27: D4.Y30(IO,_FPLL_BR_CLKOUT0,_FPLL_BR_CLKOUTp,_FPLL_BR_FB,_(DIFFIO_TX_R36p,_DIFFOUT_R36p,_DQ5R))
cy_dq28: D4.AA28(IO,_(DIFFIO_RX_R19p,_DIFFOUT_R19p,_DQ3R,_DQ1R))
cy_dq29: D4.W30(IO,_FPLL_BR_CLKOUT1,_FPLL_BR_CLKOUTn,_(DIFFIO_TX_R36n,_DIFFOUT_R36n,_DQ5R))
cy_dq30: D4.AE23(IO,_(DIFFIO_TX_R10p,_DIFFOUT_R10p,_DQ2R))
cy_dq31: D4.W29(IO,_(DIFFIO_TX_R38n,_DIFFOUT_R38n,_DQ5R))
cy_pclk: D4.AB26(IO,_DEV_OE,_(DIFFIO_TX_R5p,_DIFFOUT_R5p))
ttl_rx: D4.Y23(IO,_nPERSTL0,_(DIFFIO_RX_R6p,_DIFFOUT_R6p,_DQS1R))
ttl_tx: D4.Y25(IO,_(DIFFIO_RX_R4p,_DIFFOUT_R4p,_DQ1R))
ttl_tx_en: D4.AA24(IO,_(DIFFIO_RX_R9p,_DIFFOUT_R9p))
NetD4_AD23: D4.AD23(IO,_RZQ_1,_(DIFFIO_TX_R1p,_DIFFOUT_R1p,_DQ1R)) R22.1

Not connected (* = marked no-connect by the designer): D4 AA23(IO,_(DIFFIO_RX_R8n,_DIFFOUT_R8n,_DQ1R))* AA29(IO,_(DIFFIO_RX_R31p,_DIFFOUT_R31p,_DQ4R,_DQ1R))* AB27(IO,_(DIFFIO_TX_R32p,_DIFFOUT_R32p,_DQ4R,_DQ1R))* AB28(IO,_(DIFFIO_TX_R32n,_DIFFOUT_R32n))* AE27(IO,_(DIFFIO_RX_R11p,_DIFFOUT_R11p,_DQ2R))* AE28(IO,_(DIFFIO_TX_R28p,_DIFFOUT_R28p,_DQ4R,_DQ1R))* F25(IO,_(DIFFIO_RX_R63p,_DIFFOUT_R63p,_DQ8R,_DQ2R)) F26(IO,_(DIFFIO_RX_R63n,_DIFFOUT_R63n,_DQ8R,_DQ2R)) G26(IO,_(DIFFIO_TX_R62n,_DIFFOUT_R62n,_DQ8R,_DQ2R)) H24(IO,_(DIFFIO_TX_R80p,_DIFFOUT_R80p,_DQ10R,_DQ3R)) H25(IO,_(DIFFIO_RX_R75p,_DIFFOUT_R75p,_DQ10R,_DQ3R)) H26(IO,_(DIFFIO_RX_R75n,_DIFFOUT_R75n,_DQ10R,_DQ3R)) H27(IO,_(DIFFIO_TX_R62p,_DIFFOUT_R62p)) J22(IO,_(DIFFIO_RX_R79p,_DIFFOUT_R79p,_DQ10R,_DQ3R)) J23(IO,_(DIFFIO_RX_R79n,_DIFFOUT_R79n,_DQ10R,_DQ3R)) K21(IO,_(DIFFIO_RX_R71p,_DIFFOUT_R71p,_DQ9R,_DQ3R)) K22(IO,_(DIFFIO_RX_R71n,_DIFFOUT_R71n,_DQ9R,_DQ3R)) L21(IO,_(DIFFIO_RX_R73n,_DIFFOUT_R73n)) L23(IO,_(DIFFIO_RX_R67p,_DIFFOUT_R67p,_DQ9R,_DQ3R)) L24(IO,_(DIFFIO_RX_R67n,_DIFFOUT_R67n,_DQ9R,_DQ3R)) M21(IO,_(DIFFIO_RX_R73p,_DIFFOUT_R73p)) M22(IO,_(DIFFIO_RX_R69n,_DIFFOUT_R69n,_DQSn9R,_DQSn3R)) M23(IO,_(DIFFIO_RX_R61n,_DIFFOUT_R61n,_DQSn8R,_DQ2R)) N20(IO,_(DIFFIO_RX_R77n,_DIFFOUT_R77n,_DQSn10R,_DQ3R)) N21(IO,_(DIFFIO_RX_R69p,_DIFFOUT_R69p,_DQS9R,_DQS3R)) N22(IO,_(DIFFIO_RX_R61p,_DIFFOUT_R61p,_DQS8R,_DQ2R)) N24(IO,_(DIFFIO_RX_R53p,_DIFFOUT_R53p,_DQS7R,_DQS2R)) N25(IO,_(DIFFIO_RX_R53n,_DIFFOUT_R53n,_DQSn7R,_DQSn2R)) N26(IO,_(DIFFIO_RX_R51p,_DIFFOUT_R51p,_DQ7R,_DQ2R)) N27(IO,_(DIFFIO_RX_R51n,_DIFFOUT_R51n,_DQ7R,_DQ2R)) P20(IO,_(DIFFIO_RX_R77p,_DIFFOUT_R77p,_DQS10R,_DQ3R)) P25(IO,_(DIFFIO_RX_R45p,_DIFFOUT_R45p,_DQS6R)) P29(IO,_(DIFFIO_RX_R43p,_DIFFOUT_R43p,_DQ6R)) P30(IO,_(DIFFIO_RX_R43n,_DIFFOUT_R43n,_DQ6R)) R20(IO,_(DIFFIO_RX_R65p,_DIFFOUT_R65p)) R21(IO,_(DIFFIO_RX_R57p,_DIFFOUT_R57p)) R22(IO,_(DIFFIO_RX_R57n,_DIFFOUT_R57n)) R23(IO,_CLK5n,_(DIFFIO_RX_R41n,_DIFFOUT_R41n)) R25(IO,_(DIFFIO_RX_R45n,_DIFFOUT_R45n,_DQSn6R)) R26(IO,_(DIFFIO_RX_R37n,_DIFFOUT_R37n,_DQSn5R))* R27(IO,_(DIFFIO_RX_R47p,_DIFFOUT_R47p,_DQ6R)) R28(IO,_(DIFFIO_RX_R47n,_DIFFOUT_R47n,_DQ6R)) R30(IO,_(DIFFIO_RX_R39n,_DIFFOUT_R39n,_DQ5R))* T21(IO,_(DIFFIO_RX_R65n,_DIFFOUT_R65n)) T23(IO,_CLK5p,_(DIFFIO_RX_R41p,_DIFFOUT_R41p)) T25(IO,_(DIFFIO_RX_R37p,_DIFFOUT_R37p,_DQS5R))* T28(IO,_(DIFFIO_RX_R35p,_DIFFOUT_R35p,_DQ5R))* T30(IO,_(DIFFIO_RX_R39p,_DIFFOUT_R39p,_DQ5R))* U21(IO,_CLK7p,_FPLL_BR_FBp,_(DIFFIO_RX_R25p,_DIFFOUT_R25p))* U22(IO,_CLK7n,_FPLL_BR_FBn,_(DIFFIO_RX_R25n,_DIFFOUT_R25n))* U23(IO,_CLK6p,_(DIFFIO_RX_R33p,_DIFFOUT_R33p))* U28(IO,_(DIFFIO_RX_R29n,_DIFFOUT_R29n,_DQSn4R,_DQ1R))* U29(IO,_(DIFFIO_TX_R40p,_DIFFOUT_R40p,_DQ5R))* V21(IO,_(DIFFIO_RX_R13p,_DIFFOUT_R13p,_DQS2R)) V22(IO,_(DIFFIO_RX_R13n,_DIFFOUT_R13n,_DQSn2R)) V24(IO,_(DIFFIO_RX_R17p,_DIFFOUT_R17p)) V30(IO,_(DIFFIO_TX_R40n,_DIFFOUT_R40n))* W22(IO,_INIT_DONE,_(DIFFIO_RX_R2p,_DIFFOUT_R2p)) W24(IO,_nPERSTL1,_(DIFFIO_RX_R6n,_DIFFOUT_R6n,_DQSn1R))* W28(IO,_(DIFFIO_RX_R27n,_DIFFOUT_R27n,_DQ4R,_DQ1R))* Y21(IO,_CRC_ERROR,_(DIFFIO_RX_R2n,_DIFFOUT_R2n)) Y22(IO,_(DIFFIO_RX_R8p,_DIFFOUT_R8p,_DQ1R))* Y28(IO,_(DIFFIO_RX_R19n,_DIFFOUT_R19n,_DQ3R,_DQ1R))

### Layout directives
differential pair: adc_d0_n, adc_d0_p, adc_d1_n, adc_d1_p, adc_d2_n, adc_d2_p, adc_d3_n, adc_d3_p, adc_d4_n, adc_d4_p, adc_d5_n, adc_d5_p, adc_d6_n, adc_d6_p, adc_d7_n, adc_d7_p, adc_d8_n, adc_d8_p, adc_d9_n, adc_d9_p, adc_d10_n, adc_d10_p, adc_d11_n, adc_d11_p, adc_d12_n, adc_d12_p, adc_d13_n, adc_d13_p, adc_dco_n, adc_dco_p

### Notes on the sheet
- Clock
- Title
- Size:
- Date:
- A3
- Number:
- Time:
- Revision:
- Sheet
- of
- File:
- (in symbol 5CEFA7F31C8N, part D) BANK 5A
- (in symbol 5CEFA7F31C8N, part E) BANK 5B
- (in symbol 5CEFA7F31C8N, part F) BANK 6A

### Library data of the parts
D4 = 5CEFA7F31C8N: Cyclone V E Family FPGA, 1.07 to 1.13 V Supply, 480 I/O Pins, 7 PLLs, 896-Pin FBGA, Speed Grade 8, Commercial Grade, RoHS Compliant; Manufacturer: Altera; Device Group: 5CEFA7; GPIO: 480; Logic Elements (LE) (K): 149.5; Speed Grade: 8; DatasheetVersion: Rev. 3.1; PackageReference: 896-FBGA-2000A; PackageDescription: 896-Pin FineLine Ball-Grid Array (FBGA), Body 31 x 31 mm, Pitch 1 mm; Supplier 1: Digi-Key; Supplier Part Number 1: 544-2768-ND; Supplier 2: Mouser; Supplier Part Number 2: 989-5CEFA7F31C8N; RoHS: RoHS Compliant; Subcategory: Cyclone V E; Voltage Supply: 1.07 to 1.13 V; Mounting Technology: Surface Mount; Code_JEDEC: MS-034-AAN-1; PartNumber: 5CEFA7F31C8N; ComponentLink1Description: Manufacturer URL; ComponentLink1URL: http://www.altera.com; ComponentLink2Description: Datasheet; ComponentLink2URL: http://www.altera.com/literature/hb/cyclone-v/cv_51002.pdf; ComponentLink3Description: Package Specification; ComponentLink3URL: http://www.altera.com/devicepackaging/04R00435-01.pdf; ComponentLink4Description: Device Handbook URL; ComponentLink4URL: http://www.altera.com/literature/hb/cyclone-v/cyclone5_handbook.pdf; ComponentLink5Description: Device Overview URL; ComponentLink5URL: http://www.altera.com/literature/hb/cyclone-v/cv_51001.pdf; ComponentLink6Description: Device Pin-Out URL; ComponentLink6URL: http://www.altera.com/literature/dp/cyclone-v/1.1.txt; ComponentLink7Description: Product URL; ComponentLink7URL: http://www.buyaltera.com/scripts/partsearch.dll?Detail&name=5CEFA7F31C8N-ND
R22 = RES_0603: 1K 0.1W 5% 0603 (1608 Metric)  SMD; Case-EIA: 0603; Case-Metric: 1608; Technology: SMT; Value: 240; Tolerance: 5 %; Power: 0.1 W

## Sheet as14120_x31_ddr.SchDoc
size A3; PageSetup: Record=PageOptions|CenterHorizontal=True|CenterVertical=True|PrintScale=1.05|XCorrection=1.00|YCorrection=1.00|PrintKind=0|BorderSize=5000000|LeftOffset=0|BottomOffset=0|Orientation=2|PaperLength=3060|PaperWidth=2190|Scale=100|PaperSource=7|PrintQuality=-4|MediaType=1|DitherType=10|PaperKind=A3 (без полей / бумага продольной резки) (297 x 420 мм)|PrintScaleMode=1
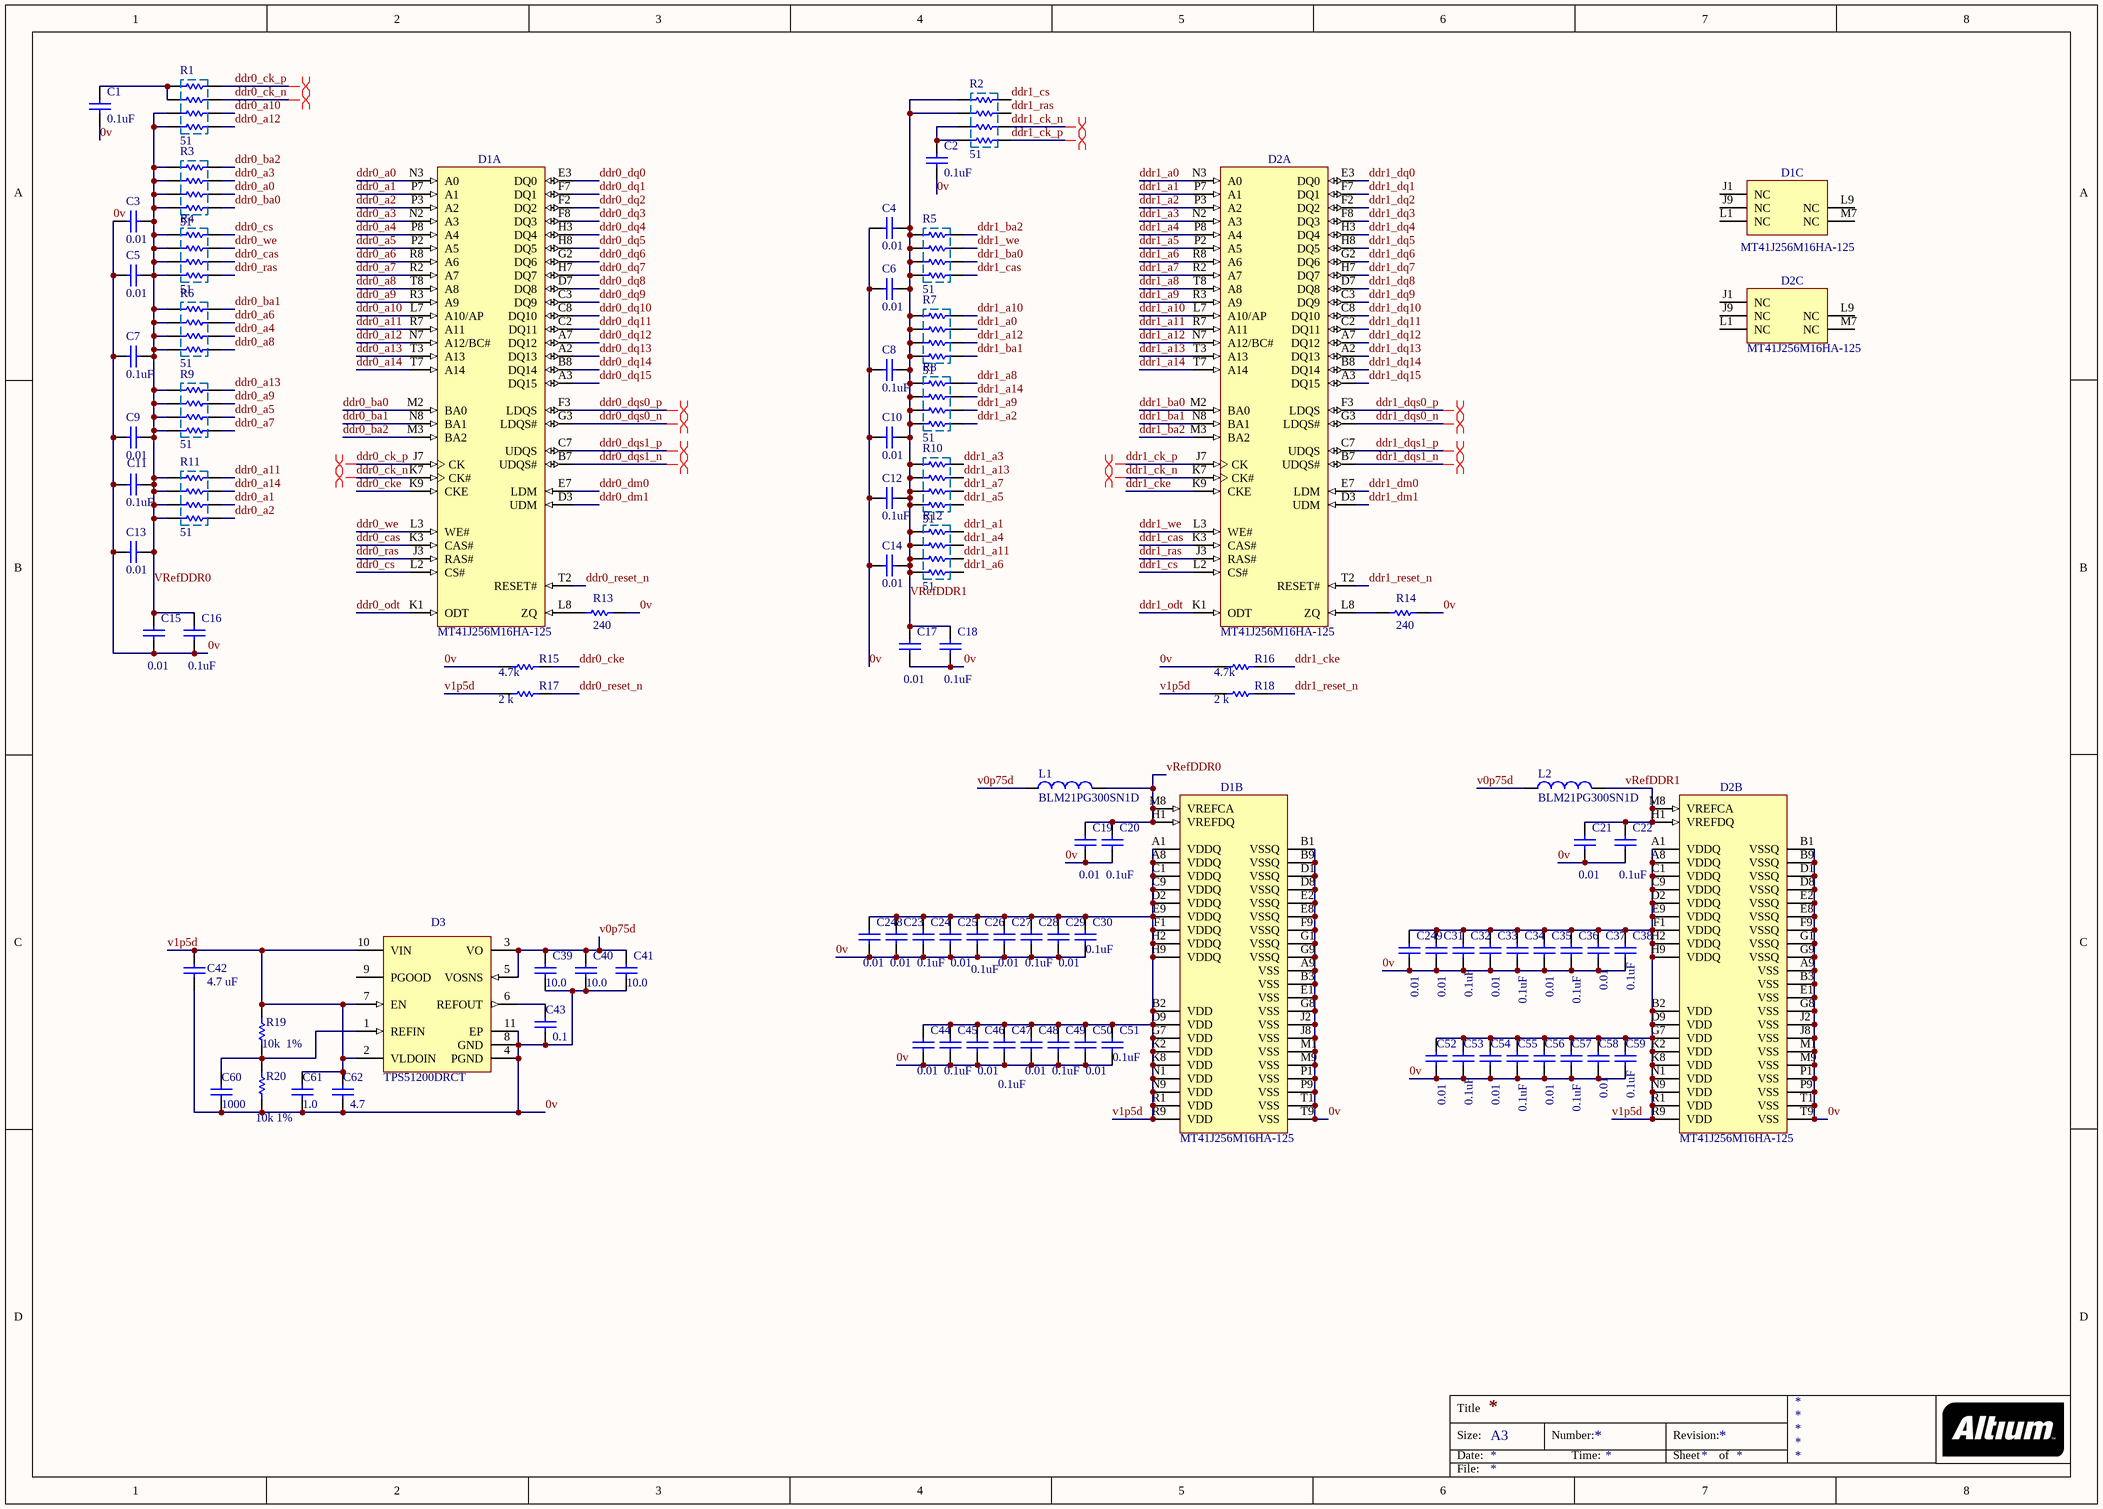
[diagram p6: as14120_x31_ddr.SchDoc]

### Parts
C1  value 0.1uF  [CAPC0402(1005)60_M]  (hidden comment: CAP 1uF 10V 0402(1005))
C2  value 0.1uF  [CAPC0402(1005)60_M]  (hidden comment: CAP 1uF 10V 0402(1005))
C3  value 0.01  [CAPC0402(1005)60_M]  (hidden comment: CAP 1uF 10V 0402(1005))
C4  value 0.01  [CAPC0402(1005)60_M]  (hidden comment: CAP 1uF 10V 0402(1005))
C5  value 0.01  [CAPC0402(1005)60_M]  (hidden comment: CAP 1uF 10V 0402(1005))
C6  value 0.01  [CAPC0402(1005)60_M]  (hidden comment: CAP 1uF 10V 0402(1005))
C7  value 0.1uF  [CAPC0402(1005)60_M]  (hidden comment: CAP 1uF 10V 0402(1005))
C8  value 0.1uF  [CAPC0402(1005)60_M]  (hidden comment: CAP 1uF 10V 0402(1005))
C9  value 0.01  [CAPC0402(1005)60_M]  (hidden comment: CAP 1uF 10V 0402(1005))
C10  value 0.01  [CAPC0402(1005)60_M]  (hidden comment: CAP 1uF 10V 0402(1005))
C11  value 0.1uF  [CAPC0402(1005)60_M]  (hidden comment: CAP 1uF 10V 0402(1005))
C12  value 0.1uF  [CAPC0402(1005)60_M]  (hidden comment: CAP 1uF 10V 0402(1005))
C13  value 0.01  [CAPC0402(1005)60_M]  (hidden comment: CAP 1uF 10V 0402(1005))
C14  value 0.01  [CAPC0402(1005)60_M]  (hidden comment: CAP 1uF 10V 0402(1005))
C15  value 0.01  [CAPC0402(1005)60_M]  (hidden comment: CAP 1uF 10V 0402(1005))
C16  value 0.1uF  [CAPC0402(1005)60_M]  (hidden comment: CAP 1uF 10V 0402(1005))
C17  value 0.01  [CAPC0402(1005)60_M]  (hidden comment: CAP 1uF 10V 0402(1005))
C18  value 0.1uF  [CAPC0402(1005)60_M]  (hidden comment: CAP 1uF 10V 0402(1005))
C19  value 0.01  [CAPC0402(1005)60_M]  (hidden comment: CAP 1uF 10V 0402(1005))
C20  value 0.1uF  [CAPC0402(1005)60_M]  (hidden comment: CAP 1uF 10V 0402(1005))
C21  value 0.01  [CAPC0402(1005)60_M]  (hidden comment: CAP 1uF 10V 0402(1005))
C22  value 0.1uF  [CAPC0402(1005)60_M]  (hidden comment: CAP 1uF 10V 0402(1005))
C23  value 0.01  [CAPC0402(1005)60_M]  (hidden comment: CAP 1uF 10V 0402(1005))
C24  value 0.1uF  [CAPC0402(1005)60_M]  (hidden comment: CAP 1uF 10V 0402(1005))
C25  value 0.01  [CAPC0402(1005)60_M]  (hidden comment: CAP 1uF 10V 0402(1005))
C26  value 0.1uF  [CAPC0402(1005)60_M]  (hidden comment: CAP 1uF 10V 0402(1005))
C27  value 0.01  [CAPC0402(1005)60_M]  (hidden comment: CAP 1uF 10V 0402(1005))
C28  value 0.1uF  [CAPC0402(1005)60_M]  (hidden comment: CAP 1uF 10V 0402(1005))
C29  value 0.01  [CAPC0402(1005)60_M]  (hidden comment: CAP 1uF 10V 0402(1005))
C30  value 0.1uF  [CAPC0402(1005)60_M]  (hidden comment: CAP 1uF 10V 0402(1005))
C31  value 0.01  [CAPC0402(1005)60_M]  (hidden comment: CAP 1uF 10V 0402(1005))
C32  value 0.1uF  [CAPC0402(1005)60_M]  (hidden comment: CAP 1uF 10V 0402(1005))
C33  value 0.01  [CAPC0402(1005)60_M]  (hidden comment: CAP 1uF 10V 0402(1005))
C34  value 0.1uF  [CAPC0402(1005)60_M]  (hidden comment: CAP 1uF 10V 0402(1005))
C35  value 0.01  [CAPC0402(1005)60_M]  (hidden comment: CAP 1uF 10V 0402(1005))
C36  value 0.1uF  [CAPC0402(1005)60_M]  (hidden comment: CAP 1uF 10V 0402(1005))
C37  value 0.01  [CAPC0402(1005)60_M]  (hidden comment: CAP 1uF 10V 0402(1005))
C38  value 0.1uF  [CAPC0402(1005)60_M]  (hidden comment: CAP 1uF 10V 0402(1005))
C39  value 10.0  [CAPC0805(2012)100_N]  (hidden comment: CAP_0805)
C40  value 10.0  [CAPC0805(2012)100_N]  (hidden comment: CAP_0805)
C41  value 10.0  [CAPC0805(2012)100_N]  (hidden comment: CAP_0805)
C42  value 4.7 uF  [CAPC0805(2012)100_N]  (hidden comment: CAP_0805)
C43  value 0.1  [CAPC0805(2012)100_N]  (hidden comment: CAP_0805)
C44  value 0.01  [CAPC0402(1005)60_M]  (hidden comment: CAP 1uF 10V 0402(1005))
C45  value 0.1uF  [CAPC0402(1005)60_M]  (hidden comment: CAP 1uF 10V 0402(1005))
C46  value 0.01  [CAPC0402(1005)60_M]  (hidden comment: CAP 1uF 10V 0402(1005))
C47  value 0.1uF  [CAPC0402(1005)60_M]  (hidden comment: CAP 1uF 10V 0402(1005))
C48  value 0.01  [CAPC0402(1005)60_M]  (hidden comment: CAP 1uF 10V 0402(1005))
C49  value 0.1uF  [CAPC0402(1005)60_M]  (hidden comment: CAP 1uF 10V 0402(1005))
C50  value 0.01  [CAPC0402(1005)60_M]  (hidden comment: CAP 1uF 10V 0402(1005))
C51  value 0.1uF  [CAPC0402(1005)60_M]  (hidden comment: CAP 1uF 10V 0402(1005))
C52  value 0.01  [CAPC0402(1005)60_M]  (hidden comment: CAP 1uF 10V 0402(1005))
C53  value 0.1uF  [CAPC0402(1005)60_M]  (hidden comment: CAP 1uF 10V 0402(1005))
C54  value 0.01  [CAPC0402(1005)60_M]  (hidden comment: CAP 1uF 10V 0402(1005))
C55  value 0.1uF  [CAPC0402(1005)60_M]  (hidden comment: CAP 1uF 10V 0402(1005))
C56  value 0.01  [CAPC0402(1005)60_M]  (hidden comment: CAP 1uF 10V 0402(1005))
C57  value 0.1uF  [CAPC0402(1005)60_M]  (hidden comment: CAP 1uF 10V 0402(1005))
C58  value 0.01  [CAPC0402(1005)60_M]  (hidden comment: CAP 1uF 10V 0402(1005))
C59  value 0.1uF  [CAPC0402(1005)60_M]  (hidden comment: CAP 1uF 10V 0402(1005))
C60  value 1000  [CAPC0805(2012)100_N]  (hidden comment: CAP_0805)
C61  value 1.0  [CAPC0805(2012)100_N]  (hidden comment: CAP_0805)
C62  value 4.7  [CAPC0805(2012)100_N]  (hidden comment: CAP_0805)
C248  value 0.01  [CAPC0402(1005)60_M]  (hidden comment: CAP 1uF 10V 0402(1005))
C249  value 0.01  [CAPC0402(1005)60_M]  (hidden comment: CAP 1uF 10V 0402(1005))
D1  MT41J256M16HA-125  [MICT-HA-96]  (parts A,B,C of 3)
D2  MT41J256M16HA-125  [MICT-HA-96]  (parts A,B,C of 3)
D3  TPS51200DRCT  [TI-DRC10-2400X1650TP_V]
L1  BLM21PG300SN1D  [CAPC0805(2012)100_N]
L2  BLM21PG300SN1D  [CAPC0805(2012)100_N]
R1  51  [CAY16]
R2  51  [CAY16]
R3  51  [CAY16]
R4  51  [CAY16]
R5  51  [CAY16]
R6  51  [CAY16]
R7  51  [CAY16]
R8  51  [CAY16]
R9  51  [CAY16]
R10  51  [CAY16]
R11  51  [CAY16]
R12  51  [CAY16]
R13  value 240  [RESC0805(2012)_L]  (hidden comment: 1K 1% 0805(2012))
R14  value 240  [RESC0805(2012)_L]  (hidden comment: 1K 1% 0805(2012))
R15  value 4.7k  [RESC0805(2012)_L]  (hidden comment: 1K 1% 0805(2012))
R16  value 4.7k  [RESC0805(2012)_L]  (hidden comment: 1K 1% 0805(2012))
R17  value 2 k  [RESC0805(2012)_L]  (hidden comment: 1K 1% 0805(2012))
R18  value 2 k  [RESC0805(2012)_L]  (hidden comment: 1K 1% 0805(2012))
R19  value 10k  1%  [RESC0805(2012)_L]  (hidden comment: 1K 1% 0805(2012))
R20  value 10k 1%  [RESC0805(2012)_L]  (hidden comment: 1K 1% 0805(2012))

### Nets
0v: C1.1 C2.1 C3.2 C4.2 C5.2 C6.2 C7.2 C8.2 C9.2 C10.2 C11.2 C12.2 C13.2 C14.2 C15.1 C16.1 C17.1 C18.1 C19.1 C20.1 C21.1 C22.1 C23.1 C24.1 C25.1 C26.1 C27.1 C28.1 C29.1 C30.1 C31.1 C32.1 C33.1 C34.1 C35.1 C36.1 C37.1 C38.1 C39.1 C40.1 C41.1 C42.1 C43.1 C44.1 C45.1 C46.1 C47.1 C48.1 C49.1 C50.1 C51.1 C52.1 C53.1 C54.1 C55.1 C56.1 C57.1 C58.1 C59.1 C60.1 C61.1 C62.1 C248.1 C249.1 D1.A9(VSS) D1.B1(VSSQ) D1.B3(VSS) D1.B9(VSSQ) D1.D1(VSSQ) D1.D8(VSSQ) D1.E1(VSS) D1.E2(VSSQ) D1.E8(VSSQ) D1.F9(VSSQ) D1.G1(VSSQ) D1.G8(VSS) D1.G9(VSSQ) D1.J2(VSS) D1.J8(VSS) D1.M1(VSS) D1.M9(VSS) D1.P1(VSS) D1.P9(VSS) D1.T1(VSS) D1.T9(VSS) D2.A9(VSS) D2.B1(VSSQ) D2.B3(VSS) D2.B9(VSSQ) D2.D1(VSSQ) D2.D8(VSSQ) D2.E1(VSS) D2.E2(VSSQ) D2.E8(VSSQ) D2.F9(VSSQ) D2.G1(VSSQ) D2.G8(VSS) D2.G9(VSSQ) D2.J2(VSS) D2.J8(VSS) D2.M1(VSS) D2.M9(VSS) D2.P1(VSS) D2.P9(VSS) D2.T1(VSS) D2.T9(VSS) D3.4(PGND) D3.8(GND) D3.11(EP) R13.2 R14.2 R15.1 R16.1 R20.1
ddr0_a0: D1.N3(A0) R3.6
ddr0_a1: D1.P7(A1) R11.6
ddr0_a2: D1.P3(A2) R11.5
ddr0_a3: D1.N2(A3) R3.7
ddr0_a4: D1.P8(A4) R6.6
ddr0_a5: D1.P2(A5) R9.6
ddr0_a6: D1.R8(A6) R6.7
ddr0_a7: D1.R2(A7) R9.5
ddr0_a8: D1.T8(A8) R6.5
ddr0_a9: D1.R3(A9) R9.7
ddr0_a10: D1.L7(A10/AP) R1.6
ddr0_a11: D1.R7(A11) R11.8
ddr0_a12: D1.N7(A12/BC#) R1.5
ddr0_a13: D1.T3(A13) R9.8
ddr0_a14: D1.T7(A14) R11.7
ddr0_ba0: D1.M2(BA0) R3.5
ddr0_ba1: D1.N8(BA1) R6.8
ddr0_ba2: D1.M3(BA2) R3.8
ddr0_cas: D1.K3(CAS#) R4.6
ddr0_ck_n: D1.K7(CK#) R1.7
ddr0_ck_p: D1.J7(CK) R1.8
ddr0_cke: D1.K9(CKE) R15.2
ddr0_cs: D1.L2(CS#) R4.8
ddr0_dm0: D1.E7(LDM)
ddr0_dm1: D1.D3(UDM)
ddr0_dq0: D1.E3(DQ0)
ddr0_dq1: D1.F7(DQ1)
ddr0_dq2: D1.F2(DQ2)
ddr0_dq3: D1.F8(DQ3)
ddr0_dq4: D1.H3(DQ4)
ddr0_dq5: D1.H8(DQ5)
ddr0_dq6: D1.G2(DQ6)
ddr0_dq7: D1.H7(DQ7)
ddr0_dq8: D1.D7(DQ8)
ddr0_dq9: D1.C3(DQ9)
ddr0_dq10: D1.C8(DQ10)
ddr0_dq11: D1.C2(DQ11)
ddr0_dq12: D1.A7(DQ12)
ddr0_dq13: D1.A2(DQ13)
ddr0_dq14: D1.B8(DQ14)
ddr0_dq15: D1.A3(DQ15)
ddr0_dqs0_n: D1.G3(LDQS#)
ddr0_dqs0_p: D1.F3(LDQS)
ddr0_dqs1_n: D1.B7(UDQS#)
ddr0_dqs1_p: D1.C7(UDQS)
ddr0_odt: D1.K1(ODT)
ddr0_ras: D1.J3(RAS#) R4.5
ddr0_reset_n: D1.T2(RESET#) R17.2
ddr0_we: D1.L3(WE#) R4.7
ddr1_a0: D2.N3(A0) R7.7
ddr1_a1: D2.P7(A1) R12.8
ddr1_a2: D2.P3(A2) R8.5
ddr1_a3: D2.N2(A3) R10.8
ddr1_a4: D2.P8(A4) R12.7
ddr1_a5: D2.P2(A5) R10.5
ddr1_a6: D2.R8(A6) R12.5
ddr1_a7: D2.R2(A7) R10.6
ddr1_a8: D2.T8(A8) R8.8
ddr1_a9: D2.R3(A9) R8.6
ddr1_a10: D2.L7(A10/AP) R7.8
ddr1_a11: D2.R7(A11) R12.6
ddr1_a12: D2.N7(A12/BC#) R7.6
ddr1_a13: D2.T3(A13) R10.7
ddr1_a14: D2.T7(A14) R8.7
ddr1_ba0: D2.M2(BA0) R5.6
ddr1_ba1: D2.N8(BA1) R7.5
ddr1_ba2: D2.M3(BA2) R5.8
ddr1_cas: D2.K3(CAS#) R5.5
ddr1_ck_n: D2.K7(CK#) R2.6
ddr1_ck_p: D2.J7(CK) R2.5
ddr1_cke: D2.K9(CKE) R16.2
ddr1_cs: D2.L2(CS#) R2.8
ddr1_dm0: D2.E7(LDM)
ddr1_dm1: D2.D3(UDM)
ddr1_dq0: D2.E3(DQ0)
ddr1_dq1: D2.F7(DQ1)
ddr1_dq2: D2.F2(DQ2)
ddr1_dq3: D2.F8(DQ3)
ddr1_dq4: D2.H3(DQ4)
ddr1_dq5: D2.H8(DQ5)
ddr1_dq6: D2.G2(DQ6)
ddr1_dq7: D2.H7(DQ7)
ddr1_dq8: D2.D7(DQ8)
ddr1_dq9: D2.C3(DQ9)
ddr1_dq10: D2.C8(DQ10)
ddr1_dq11: D2.C2(DQ11)
ddr1_dq12: D2.A7(DQ12)
ddr1_dq13: D2.A2(DQ13)
ddr1_dq14: D2.B8(DQ14)
ddr1_dq15: D2.A3(DQ15)
ddr1_dqs0_n: D2.G3(LDQS#)
ddr1_dqs0_p: D2.F3(LDQS)
ddr1_dqs1_n: D2.B7(UDQS#)
ddr1_dqs1_p: D2.C7(UDQS)
ddr1_odt: D2.K1(ODT)
ddr1_ras: D2.J3(RAS#) R2.7
ddr1_reset_n: D2.T2(RESET#) R18.2
ddr1_we: D2.L3(WE#) R5.7
v0p75d: C39.2 C40.2 C41.2 D3.3(VO) D3.5(VOSNS) L1.1 L2.1
v1p5d: C23.2 C24.2 C25.2 C26.2 C27.2 C28.2 C29.2 C30.2 C31.2 C32.2 C33.2 C34.2 C35.2 C36.2 C37.2 C38.2 C42.2 C44.2 C45.2 C46.2 C47.2 C48.2 C49.2 C50.2 C51.2 C52.2 C53.2 C54.2 C55.2 C56.2 C57.2 C58.2 C59.2 C61.2 C62.2 C248.2 C249.2 D1.A1(VDDQ) D1.A8(VDDQ) D1.B2(VDD) D1.C1(VDDQ) D1.C9(VDDQ) D1.D2(VDDQ) D1.D9(VDD) D1.E9(VDDQ) D1.F1(VDDQ) D1.G7(VDD) D1.H2(VDDQ) D1.H9(VDDQ) D1.K2(VDD) D1.K8(VDD) D1.N1(VDD) D1.N9(VDD) D1.R1(VDD) D1.R9(VDD) D2.A1(VDDQ) D2.A8(VDDQ) D2.B2(VDD) D2.C1(VDDQ) D2.C9(VDDQ) D2.D2(VDDQ) D2.D9(VDD) D2.E9(VDDQ) D2.F1(VDDQ) D2.G7(VDD) D2.H2(VDDQ) D2.H9(VDDQ) D2.K2(VDD) D2.K8(VDD) D2.N1(VDD) D2.N9(VDD) D2.R1(VDD) D2.R9(VDD) D3.2(VLDOIN) D3.7(EN) D3.10(VIN) R17.1 R18.1 R19.2
vRefDDR0: C3.1 C5.1 C7.1 C9.1 C11.1 C13.1 C15.2 C16.2 C19.2 C20.2 D1.H1(VREFDQ) D1.M8(VREFCA) L1.2 R1.3 R1.4 R3.1 R3.2 R3.3 R3.4 R4.1 R4.2 R4.3 R4.4 R6.1 R6.2 R6.3 R6.4 R9.1 R9.2 R9.3 R9.4 R11.1 R11.2 R11.3 R11.4
vRefDDR1: C4.1 C6.1 C8.1 C10.1 C12.1 C14.1 C17.2 C18.2 C21.2 C22.2 D2.H1(VREFDQ) D2.M8(VREFCA) L2.2 R2.1 R2.2 R5.1 R5.2 R5.3 R5.4 R7.1 R7.2 R7.3 R7.4 R8.1 R8.2 R8.3 R8.4 R10.1 R10.2 R10.3 R10.4 R12.1 R12.2 R12.3 R12.4
NetC1_2: C1.2 R1.1 R1.2
NetC2_2: C2.2 R2.3 R2.4
NetC43_2: C43.2 D3.6(REFOUT)
NetC60_2: C60.2 D3.1(REFIN) R19.1 R20.2
NetD1_L8: D1.L8(ZQ) R13.1
NetD2_L8: D2.L8(ZQ) R14.1

Not connected (* = marked no-connect by the designer): D1 J1(NC) J9(NC) L1(NC) L9(NC) M7(NC); D2 J1(NC) J9(NC) L1(NC) L9(NC) M7(NC); D3 9(PGOOD)

### Layout directives
differential pair: ddr0_ck_n, ddr0_ck_p, ddr0_dqs0_n, ddr0_dqs0_p, ddr0_dqs1_n, ddr0_dqs1_p, ddr1_ck_n, ddr1_ck_p, ddr1_dqs0_n, ddr1_dqs0_p, ddr1_dqs1_n, ddr1_dqs1_p

### Notes on the sheet
- Title
- Size:
- Date:
- A3
- Number:
- Time:
- Revision:
- Sheet
- of
- File:

### Library data of the parts
C1-C38 C44-C59 C248 C249 = CAP_0402: CAP 1uF 10V ±20% 0402 (1005 Metric) Thickness 0.6mm SMD; Case-Metric: 1005; Case-EIA: 0402; Tolerance: ±20%; Max Thickness: 0.6 mm; Rated Voltage: 10 V; Technology: SMT
D1 D2 = MT41J256M16HA-125: 4Gb DDR3-1600 SDRAM, 256Mb x 16, 1.25ns, 1.5V, 0 to 95 degC, 96-Ball FBGA, Pb-Free; Manufacturer: Micron; CL: CL = 11; Clock Rate: 800 MHz; Op. Temp.: 0C to +95C; DatasheetVersion: Rev.J; PackageVersion: Rev.E; PackageReference: MICT-HA-96; PackageDescription: 96-Ball Fine-Pitch Ball Grid Array, 14 x 9 mm, Pitch 0.8 mm; Cycle Time: 1.25ns; Data Rate: DDR3-1600; Density: 4Gb; Depth: 256Mb; Package: FBGA; Pin Count: 96-ball; RoHS: Yes; Voltage: 1.5V; Width: x16; Mounting Technology: Surface Mount; PartNumber: MT41J256M16HA-125; ComponentLink1Description: Manufacturer URL; ComponentLink1URL: http://www.micron.com/; ComponentLink2Description: Datasheet; ComponentLink2URL: http://www.micron.com/~/media/Documents/Products/Data%20Sheet/DRAM/4Gb_DDR3_SDRAM.pdf; ComponentLink3Description: Package Specification; ComponentLink3URL: http://www.micron.com/~/media/Documents/Products/Data%20Sheet/DRAM/4Gb_1_35V_DDR3L.pdf
D3 = TPS51200DRCT: Single Output LDO, 3 A, 2.375 to 3.5 V Input, with DDR Termination, 10-pin SON (DRC), -40 to 85 degC, Green (RoHS & no Sb/Br); Manufacturer: Texas Instruments; Iout(Max)(A): 3; Iq(Typ)(mA): 0.5; Power Good: TRUE; Rating: Catalog; SubFamily: Single Channel LDO; Vin(Max)(V): 3.5; Vin(Min)(V): 2.3; DatasheetVersion: SLUS812; PackageVersion: 4204102-3/L; PackageReference: DRC10-2400X1650TP; PackageDescription: 10-Pin Plastic Small Outline, Body 3 x 3 mm, Pitch 0.5 mm; Supplier 1: Digi-Key; Supplier Part Number 1: 296-23830-2-ND; Supplier 2: Digi-Key; Supplier Part Number 2: 296-23830-1-ND; Supplier 3: Digi-Key; Supplier Part Number 3: 296-23830-6-ND; Supplier 4: Farnell; Supplier Part Number 4: 1903398; Supplier 5: Newark; Supplier Part Number 5: 01P3287; Supplier 6: Newark; Supplier Part Number 6: 11N9833; Supplier 7: Mouser; Supplier Part Number 7: 595-TPS51200DRCT; Eco-Plan: Green (RoHS & no Sb/Br); Mounting Technology: Surface Mount; PartNumber: TPS51200DRCT; ComponentLink1Description: Manufacturer URL; ComponentLink1URL: http://www.ti.com/; ComponentLink2Description: Datasheet; ComponentLink2URL: http://www.ti.com/general/docs/lit/getliterature.tsp?genericPartNumber=TPS51200&fileType=pdf; ComponentLink3Description: Package Specification; ComponentLink3URL: http://www.ti.com/litv/pdf/mpds117k; ComponentLink4Description: URL Link1; ComponentLink4URL: Samples URL:http://www.ti.com/product/tps51200#samples
L1 L2 = Ferrite_beat
R1-R12 = cay16-J4: Value: 51
R13-R20 = RES_0805: 1K 0.125W 1% 0805 (2012 Metric)  SMD; Case-Metric: 2012; Case-EIA: 0805; Tolerance: 1 %; Power: 0.125 W; Technology: SMT